# EAGLE design zeta2rework (EAGLE 9.0.1)
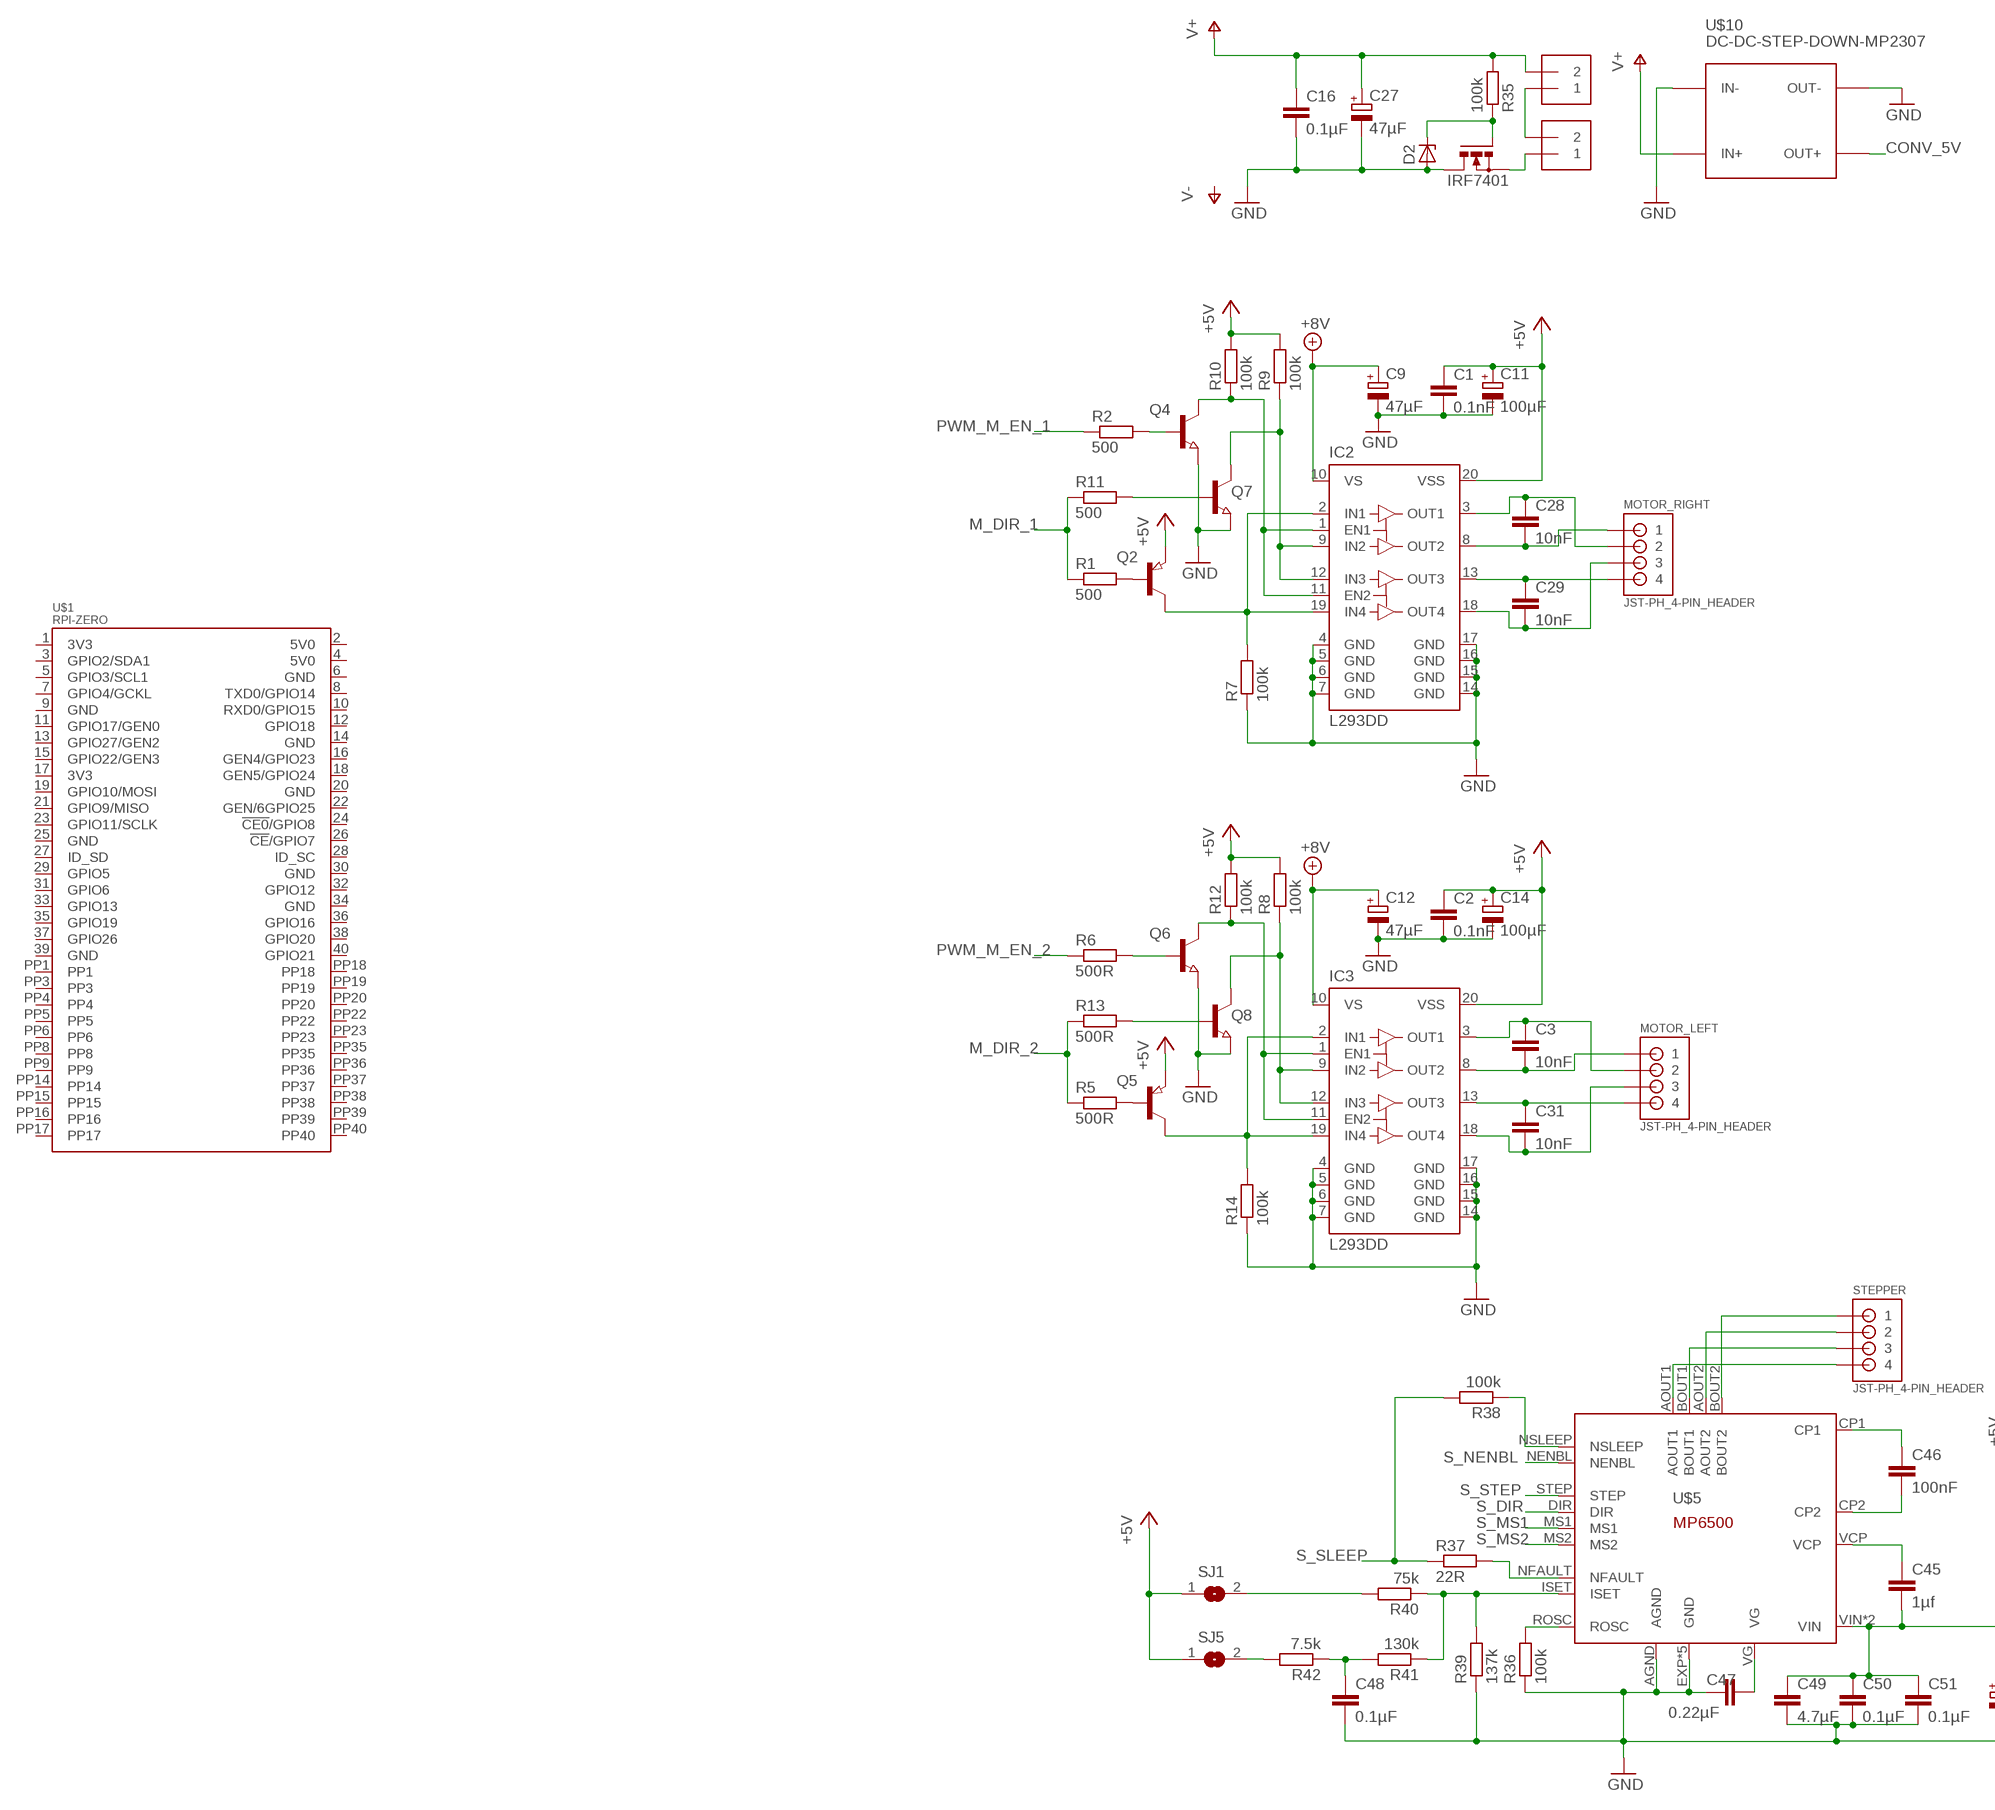
[diagram p0: schematic, sheet 1, part 1 of 2]
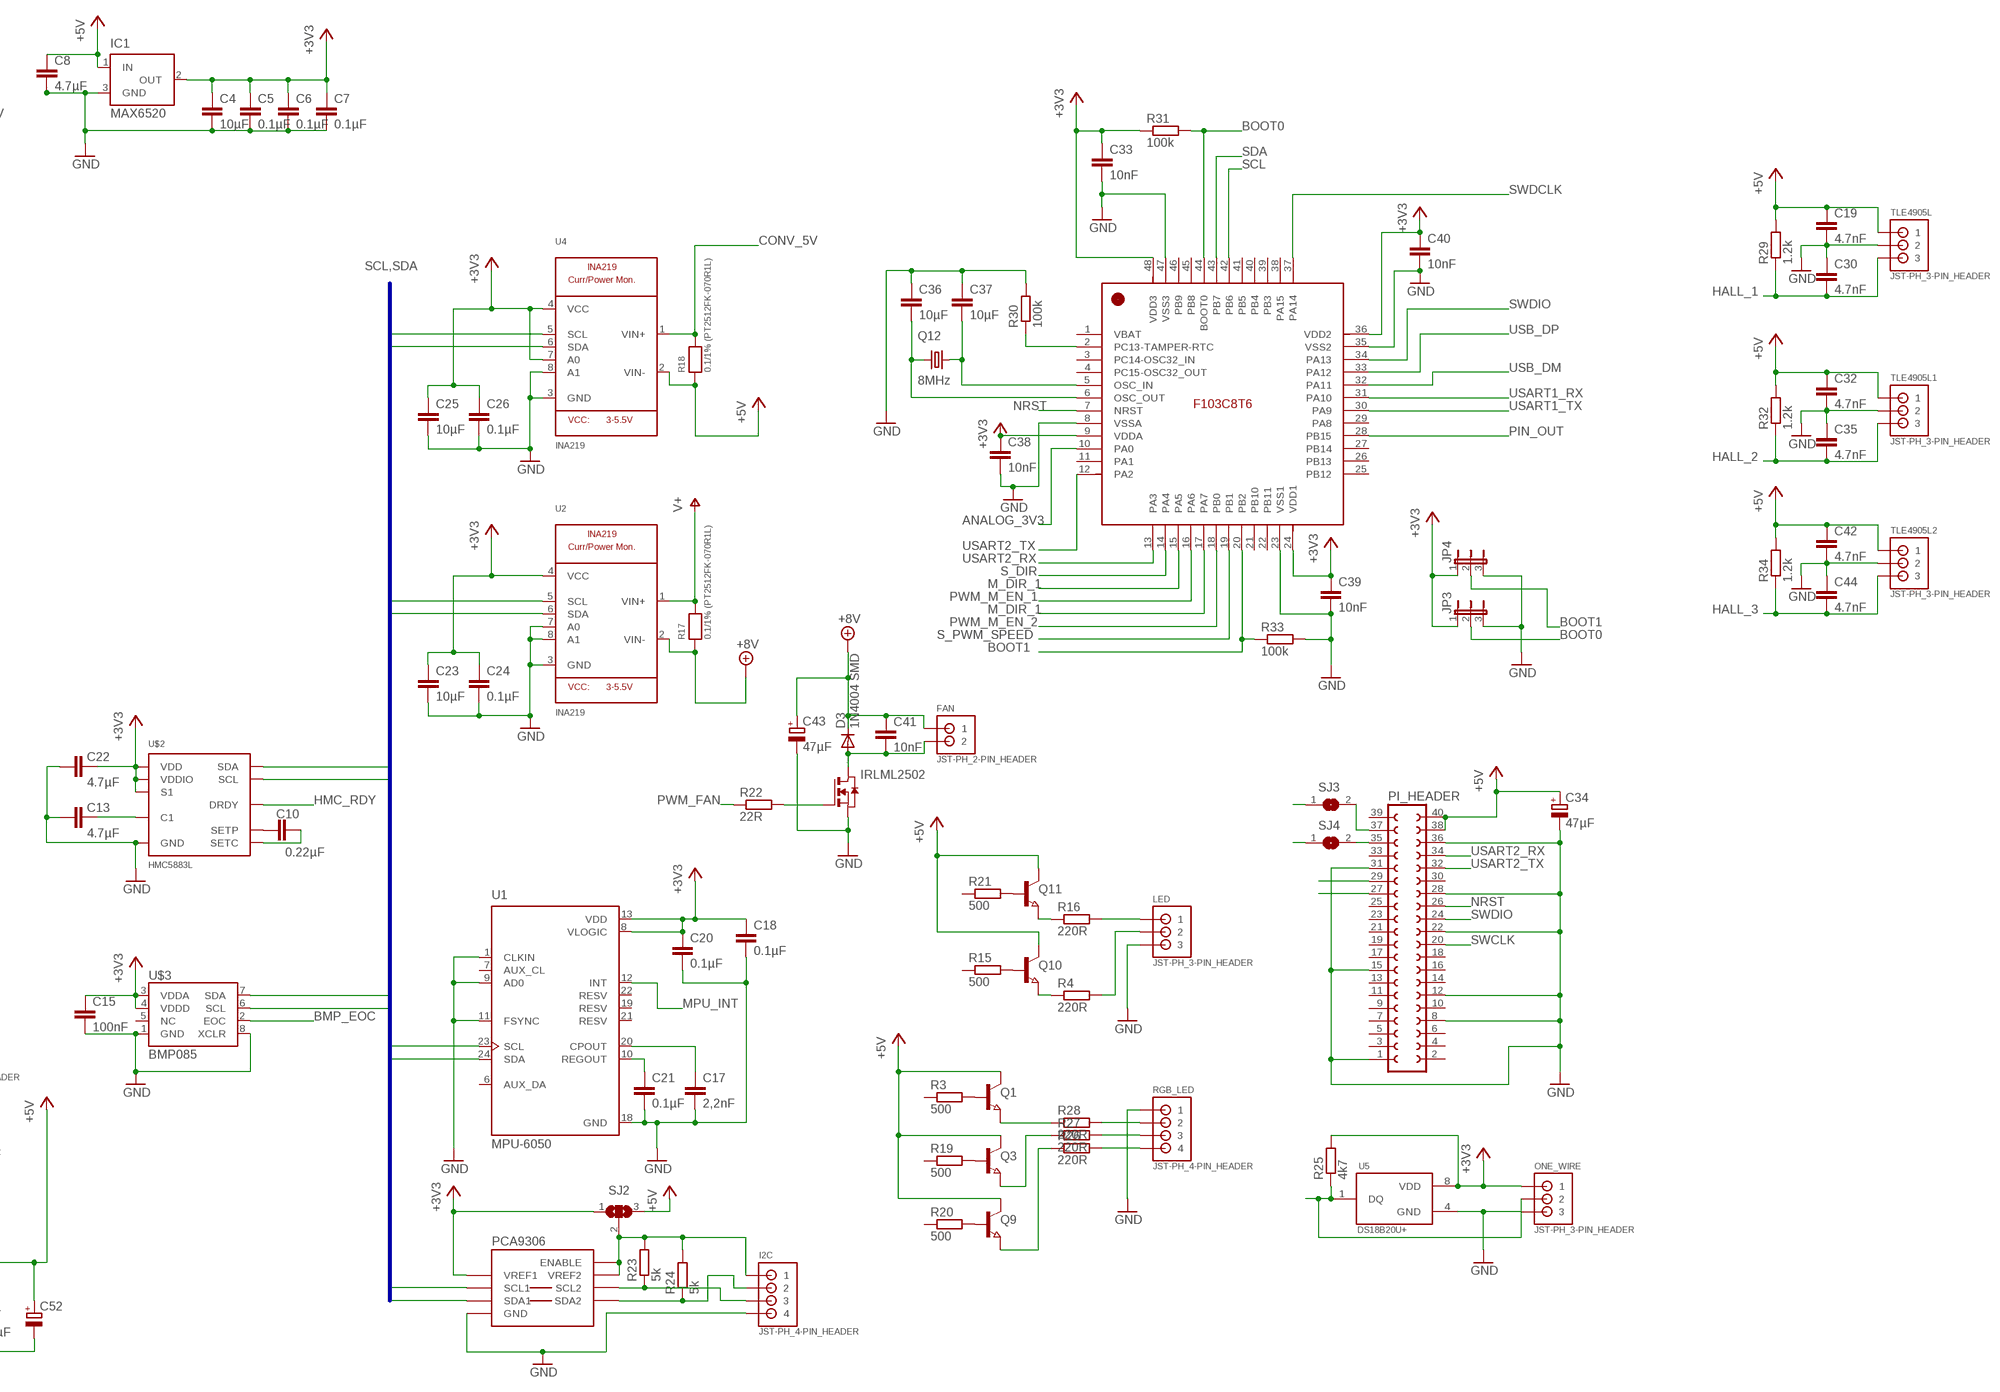
[diagram p1: schematic, sheet 1, part 2 of 2]

## Parts
C1  0.1nF  C-EUC0603  [C0603]
C2  0.1nF  C-EUC0603  [C0603]
C3  10nF  C-EUC0603  [C0603]
C4  10µF  C-EUC0603  [C0603]
C5  0.1µF  C-EUC0603  [C0603]
C6  0.1µF  C-EUC0603  [C0603]
C7  0.1µF  C-EUC0603  [C0603]
C8  4.7µF  C-EUC0603  [C0603]
C9  47µF  CPOL-EUSMCC  [SMC_C]
C10  0.22µF  C-EUC0603  [C0603]
C11  100µF  CPOL-EUSMCC  [SMC_C]
C12  47µF  CPOL-EUSMCC  [SMC_C]
C13  4.7µF  C-EUC0603  [C0603]
C14  100µF  CPOL-EUSMCC  [SMC_C]
C15  100nF  C-EUC0603  [C0603]
C16  0.1µF  C-EUC0603  [C0603]
C17  2,2nF  C-EUC0603  [C0603]
C18  0.1µF  C-EUC0603  [C0603]
C19  4.7nF  C-EUC0603  [C0603]
C20  0.1µF  C-EUC0603  [C0603]
C21  0.1µF  C-EUC0603  [C0603]
C22  4.7µF  C-EUC0603  [C0603]
C23  10µF  C-EUC0603  [C0603]
C24  0.1µF  C-EUC0603  [C0603]
C25  10µF  C-EUC0603  [C0603]
C26  0.1µF  C-EUC0603  [C0603]
C27  47µF  CPOL-EUSMCC  [SMC_C]
C28  10nF  C-EUC0603  [C0603]
C29  10nF  C-EUC0603  [C0603]
C30  4.7nF  C-EUC0603  [C0603]
C31  10nF  C-EUC0603  [C0603]
C32  4.7nF  C-EUC0603  [C0603]
C33  10nF  C-EUC0603  [C0603]
C34  47µF  CPOL-EUSMCC  [SMC_C]
C35  4.7nF  C-EUC0603  [C0603]
C36  10µF  C-EUC0603  [C0603]
C37  10µF  C-EUC0603  [C0603]
C38  10nF  C-EUC0603  [C0603]
C39  10nF  C-EUC0603  [C0603]
C40  10nF  C-EUC0603  [C0603]
C41  10nF  C-EUC0603  [C0603]
C42  4.7nF  C-EUC0603  [C0603]
C43  47µF  CPOL-EUSMCC  [SMC_C]
C44  4.7nF  C-EUC0603  [C0603]
C45  1µf  C-EUC0603  [C0603]
C46  100nF  C-EUC0603  [C0603]
C47  0.22µF  C-EUC0603  [C0603]
C48  0.1µF  C-EUC0603  [C0603]
C49  4.7µF  C-EUC0603  [C0603]
C50  0.1µF  C-EUC0603  [C0603]
C51  0.1µF  C-EUC0603  [C0603]
C52  CPOL-EU150CLZ-0810  [150CLZ-0810]
D2  ZENER-DIODESOD80C  [SOD80C]
D3  1N4004 SMD  DIODE-MELF-MLL41  [MELF-MLL41]
FAN  JST-PH_2-PIN_HEADER  [JST_B2B-PH_HEADER]
I2C  JST-PH_4-PIN_HEADER  [JST_B4B-PH_HEADER]
IC1  MAX6520  [SOT23]
IC2  L293DD  [SO20]
IC3  L293DD  [SO20]
IRF7401  N-MOSFET-SO8S  [SO-08]
IRLML2502  NMOSSOT23  [SOT-23]
JP3  JP2E  [JP2]
JP4  JP2E  [JP2]
LED  JST-PH_3-PIN_HEADER  [JST_B3B-PH_HEADER]
MOTOR_LEFT  JST-PH_4-PIN_HEADER  [JST_B4B-PH_HEADER]
MOTOR_RIGHT  JST-PH_4-PIN_HEADER  [JST_B4B-PH_HEADER]
ONE_WIRE  JST-PH_3-PIN_HEADER  [JST_B3B-PH_HEADER]
PCA9306  IC2_LEVEL_TRANSLATER  [SOIC-8]
PI_HEADER  FE20-2  [FE20-2]
Q1  NPN-TRANSISTOR_SOT23  [SOT23]
Q2  PNP-TRANSISTOR_SOT23  [SOT23]
Q3  NPN-TRANSISTOR_SOT23  [SOT23]
Q4  NPN-TRANSISTOR_SOT23  [SOT23]
Q5  PNP-TRANSISTOR_SOT23  [SOT23]
Q6  NPN-TRANSISTOR_SOT23  [SOT23]
Q7  NPN-TRANSISTOR_SOT23  [SOT23]
Q8  NPN-TRANSISTOR_SOT23  [SOT23]
Q9  NPN-TRANSISTOR_SOT23  [SOT23]
Q10  NPN-TRANSISTOR_SOT23  [SOT23]
Q11  NPN-TRANSISTOR_SOT23  [SOT23]
Q12  8MHz  KX-13  [7.0X5.0]
R1  500  R-EU_R0603  [R0603]
R2  500  R-EU_R0603  [R0603]
R3  500  R-EU_R0603  [R0603]
R4  220R  R-EU_R0603  [R0603]
R5  500R  R-EU_R0603  [R0603]
R6  500R  R-EU_R0603  [R0603]
R7  100k  R-EU_R0603  [R0603]
R8  100k  R-EU_R0603  [R0603]
R9  100k  R-EU_R0603  [R0603]
R10  100k  R-EU_R0603  [R0603]
R11  500  R-EU_R0603  [R0603]
R12  100k  R-EU_R0603  [R0603]
R13  500R  R-EU_R0603  [R0603]
R14  100k  R-EU_R0603  [R0603]
R15  500  R-EU_R0603  [R0603]
R16  220R  R-EU_R0603  [R0603]
R17  0.1/1% (PT2512FK-070R1L)  RESISTOR2512  [2512]
R18  0.1/1% (PT2512FK-070R1L)  RESISTOR2512  [2512]
R19  500  R-EU_R0603  [R0603]
R20  500  R-EU_R0603  [R0603]
R21  500  R-EU_R0603  [R0603]
R22  22R  R-EU_R0603  [R0603]
R23  5k  R-EU_R0603  [R0603]
R24  5k  R-EU_R0603  [R0603]
R25  4k7  R-EU_R0603  [R0603]
R26  220R  R-EU_R0603  [R0603]
R27  220R  R-EU_R0603  [R0603]
R28  220R  R-EU_R0603  [R0603]
R29  1.2k  R-EU_R0603  [R0603]
R30  100k  R-EU_R0603  [R0603]
R31  100k  R-EU_R0603  [R0603]
R32  1.2k  R-EU_R0603  [R0603]
R33  100k  R-EU_R0603  [R0603]
R34  1.2k  R-EU_R0603  [R0603]
R35  100k  R-EU_R0603  [R0603]
R36  100k  R-EU_R0603  [R0603]
R37  22R  R-EU_R0603  [R0603]
R38  100k  R-EU_R0603  [R0603]
R39  137k  R-EU_R0603  [R0603]
R40  75k  R-EU_R0603  [R0603]
R41  130k  R-EU_R0603  [R0603]
R42  7.5k  R-EU_R0603  [R0603]
RGB_LED  JST-PH_4-PIN_HEADER  [JST_B4B-PH_HEADER]
SJ1  SOLDERJUMPERREFLOW_NOPASTE  [SOLDERJUMPER_REFLOW_NOPASTE]
SJ2  SJ2W  [SJ_2]
SJ3  SOLDERJUMPERREFLOW_NOPASTE  [SOLDERJUMPER_REFLOW_NOPASTE]
SJ4  SOLDERJUMPERREFLOW_NOPASTE  [SOLDERJUMPER_REFLOW_NOPASTE]
SJ5  SOLDERJUMPERREFLOW_NOPASTE  [SOLDERJUMPER_REFLOW_NOPASTE]
STEPPER  JST-PH_4-PIN_HEADER  [JST_B4B-PH_HEADER]
SUPPLY_IN  TERMBLOCK_1X2-3.5MM  [1X2-3.5MM]
SUPPLY_IN1  TERMBLOCK_1X2-3.5MM  [1X2-3.5MM]
TLE4905L  JST-PH_3-PIN_HEADER  [JST_B3B-PH_HEADER]
TLE4905L1  JST-PH_3-PIN_HEADER  [JST_B3B-PH_HEADER]
TLE4905L2  JST-PH_3-PIN_HEADER  [JST_B3B-PH_HEADER]
U1  MPU-6050  [QFN50P400X400X95-24N]
U2  INA219  [SOT23-8]
U4  INA219  [SOT23-8]
U5  DS18B20U+  [SOP65P490X95-8N]
U$1  RPI-ZERO  [RASP_PI_ZERO_BOARD_FULL]
U$2  HMC5883L  [LPCC-16]
U$3  BMP085  [BMP085]
U$4  STM32F103C8T6  [LQFP48_7X7MM_0.5MMPP]
U$5  MP6500  [QFN24]
U$10  DC-DC-STEP-DOWN-MP2307  [DC-DC-STEP-DOWN-MP2307]

## Nets
+3V3: C4.1 C5.1 C6.1 C7.1 C15.1 C18.1 C20.1 C22.1 C23.1 C24.1 C25.1 C26.1 C33.1 C38.1 C39.1 C40.1 IC1.2(OUT) JP3.1 JP4.1 ONE_WIRE.P1 PCA9306.1(VREF1) R25.2 R31.1 SJ2.1 U1.8(VLOGIC) U1.13(VDD) U2.4(VCC) U4.4(VCC) U4.7(A0) U5.8(VDD) U$2.2(VDD) U$2.4(S1) U$2.13(VDDIO) U$3.3(VDDA) U$3.4(VDDD) U$4.9(VDDA) U$4.24(VDD1) U$4.36(VDD2) U$4.48(VDD3)
+5V: C1.1 C2.1 C8.1 C11.+ C14.+ C19.1 C32.1 C34.+ C42.1 C45.2 C49.1 C50.1 C51.1 C52.+ IC1.1(IN) IC2.20(VSS) IC3.20(VSS) PI_HEADER.38 PI_HEADER.40 Q1.3(C) Q2.2(E) Q3.3(C) Q5.2(E) Q9.3(C) Q10.3(C) Q11.3(C) R8.2 R9.2 R10.2 R12.2 R18.1 R29.2 R32.2 R34.2 SJ1.1 SJ2.3 SJ5.1 TLE4905L1.P1 TLE4905L2.P1 TLE4905L.P1 U4.2(VIN-) U$5.VIN U$5.VIN@1(VIN)
+8V: C9.+ C12.+ C41.1 C43.+ D3.C FAN.P1 IC2.10(VS) IC3.10(VS) R17.1 U2.2(VIN-)
ANALOG_3V3: U$4.10(PA0)
BMP_EOC: U$3.2(EOC)
BOOT0: JP3.2 R31.2 U$4.44(BOOT0)
BOOT1: JP4.2 R33.1 U$4.20(PB2)
BOOT2: PI_HEADER.29
BOOT3: PI_HEADER.27
CONV_5V: R18.2 U4.1(VIN+) U$10.OUT+
GND: C1.2 C2.2 C4.2 C5.2 C6.2 C7.2 C8.2 C9.- C11.- C12.- C13.2 C14.- C15.2 C16.2 C17.2 C18.2 C19.2 C20.2 C21.2 C22.2 C23.2 C24.2 C25.2 C26.2 C27.- C30.1 C32.2 C33.2 C34.- C35.1 C36.1 C37.1 C38.2 C39.2 C40.2 C42.2 C43.- C44.1 C47.1 C48.2 C49.2 C50.2 C51.2 C52.- D2.A I2C.P4 IC1.3(GND) IC2.4(GND) IC2.5(GND) IC2.6(GND) IC2.7(GND) IC2.14(GND) IC2.15(GND) IC2.16(GND) IC2.17(GND) IC3.4(GND) IC3.5(GND) IC3.6(GND) IC3.7(GND) IC3.14(GND) IC3.15(GND) IC3.16(GND) IC3.17(GND) IRF7401.5(D) IRF7401.6(D) IRF7401.7(D) IRF7401.8(D) IRLML2502.2(S) JP3.3 JP4.3 LED.P3 ONE_WIRE.P3 PCA9306.4(GND) PI_HEADER.1 PI_HEADER.8 PI_HEADER.12 PI_HEADER.15 PI_HEADER.22 PI_HEADER.28 PI_HEADER.31 PI_HEADER.36 Q4.2(E) Q6.2(E) Q7.2(E) Q8.2(E) R7.1 R14.1 R30.2 R33.2 R36.1 R39.1 RGB_LED.P1 TLE4905L1.P2 TLE4905L2.P2 TLE4905L.P2 U1.1(CLKIN) U1.9(AD0) U1.11(FSYNC) U1.18(GND) U2.3(GND) U2.7(A0) U2.8(A1) U4.3(GND) U4.8(A1) U5.4(GND) U$2.9(GND) U$2.11(GND) U$3.1(GND) U$3.8(XCLR) U$4.8(VSSA) U$4.23(VSS1) U$4.35(VSS2) U$4.47(VSS3) U$5.AGND U$5.EXP(GND) U$5.GND@1(GND) U$5.GND@2(GND) U$5.GND@3(GND) U$5.GND@4(GND) U$10.IN- U$10.OUT-
HALL_1: C30.2 R29.1 TLE4905L.P3
HALL_2: C35.2 R32.1 TLE4905L1.P3
HALL_3: C44.2 R34.1 TLE4905L2.P3
HMC_RDY: U$2.15(DRDY)
M_DIR_1: R1.1 R11.1 U$4.15(PA5) U$4.17(PA7)
M_DIR_2: R5.1 R13.1
MPU_INT: U1.12(INT)
N$1: IC2.9(IN2) IC2.12(IN3) Q7.3(C) R9.1
N$2: C31.2 IC3.18(OUT4) MOTOR_LEFT.P3
N$3: C31.1 IC3.13(OUT3) MOTOR_LEFT.P4
N$4: R26.2 RGB_LED.P4
N$5: IC2.2(IN1) IC2.19(IN4) Q2.3(C) R7.2
N$6: IC3.9(IN2) IC3.12(IN3) Q8.3(C) R8.1
N$7: IC3.2(IN1) IC3.19(IN4) Q5.3(C) R14.2
N$8: IC2.1(EN1) IC2.11(EN2) Q4.3(C) R10.1
N$9: IC3.1(EN1) IC3.11(EN2) Q6.3(C) R12.1
N$10: Q2.1(B) R1.2
N$11: Q7.1(B) R11.2
N$12: Q4.1(B) R2.2
N$13: Q5.1(B) R5.2
N$14: Q6.1(B) R6.2
N$15: Q8.1(B) R13.2
N$16: R27.2 RGB_LED.P3
N$17: C29.1 IC2.13(OUT3) MOTOR_RIGHT.P4
N$18: C29.2 IC2.18(OUT4) MOTOR_RIGHT.P3
N$19: R28.2 RGB_LED.P2
N$20: C28.2 IC2.8(OUT2) MOTOR_RIGHT.P1
N$21: C28.1 IC2.3(OUT1) MOTOR_RIGHT.P2
N$22: Q1.1(B) R3.2
N$23: Q3.1(B) R19.2
N$24: Q1.2(E) R28.1
N$25: C3.2 IC3.8(OUT2) MOTOR_LEFT.P1
N$26: C3.1 IC3.3(OUT1) MOTOR_LEFT.P2
N$27: Q10.1(B) R15.2
N$28: Q3.2(E) R27.1
N$29: Q9.2(E) R26.1
N$30: Q10.2(E) R4.1
N$31: Q11.1(B) R21.2
N$32: Q9.1(B) R20.2
N$33: Q11.2(E) R16.1
N$34: C17.1 U1.20(CPOUT)
N$35: LED.P1 R16.2
N$36: C21.1 U1.10(REGOUT)
N$37: IRLML2502.3(G) R22.2
N$38: C10.2 U$2.12(SETC)
N$39: C10.1 U$2.8(SETP)
N$40: C13.1 U$2.10(C1)
N$41: I2C.P1 PCA9306.7(VREF2) PCA9306.8(ENABLE) R23.2 R24.2 SJ2.2
N$42: I2C.P3 PCA9306.6(SCL2) R23.1
N$43: I2C.P2 PCA9306.5(SDA2) R24.1
N$44: PI_HEADER.37 SJ3.2
N$45: PI_HEADER.35 SJ4.2
N$46: C36.2 Q12.1 U$4.6(OSC_OUT)
N$47: C37.2 Q12.3 U$4.5(OSC_IN)
N$48: LED.P2 R4.2
N$49: R30.1 U$4.2(PC13-TAMPER-RTC)
N$50: SUPPLY_IN1.2 SUPPLY_IN.1
N$51: C45.1 U$5.VCP
N$52: R38.1 U$5.NSLEEP
N$53: C46.2 U$5.CP2
N$54: C46.1 U$5.CP1
N$55: C41.2 D3.A FAN.P2 IRLML2502.1(D)
N$56: D2.C IRF7401.4(G) R35.1
N$57: C47.2 U$5.VG
N$58: R36.2 U$5.ROSC
N$59: R37.2 U$5.NFAULT
N$60: IRF7401.1(S) IRF7401.2(S) IRF7401.3(S) SUPPLY_IN1.1
N$61: STEPPER.P1 U$5.BOUT2
N$62: STEPPER.P2 U$5.AOUT2
N$63: R39.2 R40.1 R41.1 U$5.ISET
N$64: STEPPER.P3 U$5.BOUT1
N$65: R40.2 SJ1.2
N$66: R42.2 SJ5.2
N$67: C48.1 R41.2 R42.1
N$68: STEPPER.P4 U$5.AOUT1
NRST: PI_HEADER.26 U$4.7(NRST)
PIN_OUT: U$4.28(PB15)
PWM_FAN: R22.1
PWM_M_EN_1: R2.1 U$4.16(PA6)
PWM_M_EN_2: R6.1 U$4.18(PB0)
S_DIR: U$4.14(PA4) U$5.DIR
S_MS1: U$5.MS1
S_MS2: U$5.MS2
S_NENBL: U$5.NENBL
S_PWM_SPEED: U$4.19(PB1)
S_SLEEP: R37.1 R38.2
S_STEP: U$5.STEP
SCL: U1.23(SCL) U2.5(SCL) U4.5(SCL) U$3.6(SCL) U$4.42(PB6)
SCL1: U$2.1(SCL)
SCL2: PCA9306.2(SCL1)
SCL3: SJ4.1
SDA: U1.24(SDA) U2.6(SDA) U4.6(SDA) U$3.7(SDA) U$4.43(PB7)
SDA1: U$2.16(SDA)
SDA2: PCA9306.3(SDA1)
SDA3: SJ3.1
SWCLK: PI_HEADER.20
SWDCLK: U$4.37(PA14)
SWDIO: PI_HEADER.24 U$4.34(PA13)
TEMPERATURE: ONE_WIRE.P2 R25.1 U5.1(DQ)
USART1_RX: U$4.31(PA10)
USART1_TX: U$4.30(PA9)
USART2_RX: PI_HEADER.34 U$4.13(PA3)
USART2_TX: PI_HEADER.32 U$4.12(PA2)
USB_DM: U$4.32(PA11)
USB_DP: U$4.33(PA12)
V+: C16.1 C27.+ R17.2 R35.2 SUPPLY_IN.2 U2.1(VIN+) U$10.IN+
Unconnected: PI_HEADER.2 PI_HEADER.3 PI_HEADER.4 PI_HEADER.5 PI_HEADER.6 PI_HEADER.7 PI_HEADER.9 PI_HEADER.10 PI_HEADER.11 PI_HEADER.13 PI_HEADER.14 PI_HEADER.16 PI_HEADER.17 PI_HEADER.18 PI_HEADER.19 PI_HEADER.21 PI_HEADER.23 PI_HEADER.25 PI_HEADER.30 PI_HEADER.33 PI_HEADER.39 R3.1 R15.1 R19.1 R20.1 R21.1 U1.6(AUX_DA) U1.7(AUX_CL) U1.19(RESV) U1.21(RESV) U1.22(RESV) U$1.1(3V3) U$1.2(5V0) U$1.3(GPIO2/SDA1) U$1.4(5V0) U$1.5(GPIO3/SCL1) U$1.6(GND) U$1.7(GPIO4/GCKL) U$1.8(TXD0/GPIO14) U$1.9(GND) U$1.10(RXD0/GPIO15) U$1.11(GPIO17/GEN0) U$1.12(GPIO18) U$1.13(GPIO27/GEN2) U$1.14(GND) U$1.15(GPIO22/GEN3) U$1.16(GEN4/GPIO23) U$1.17(3V3) U$1.18(GEN5/GPIO24) U$1.19(GPIO10/MOSI) U$1.20(GND) U$1.21(GPIO9/MISO) U$1.22(GEN/6GPIO25) U$1.23(GPIO11/SCLK) U$1.24(!CE0!/GPIO8) U$1.25(GND) U$1.26(!CE!/GPIO7) U$1.27(ID_SD) U$1.28(ID_SC) U$1.29(GPIO5) U$1.30(GND) U$1.31(GPIO6) U$1.32(GPIO12) U$1.33(GPIO13) U$1.34(GND) U$1.35(GPIO19) U$1.36(GPIO16) U$1.37(GPIO26) U$1.38(GPIO20) U$1.39(GND) U$1.40(GPIO21) U$1.PP1 U$1.PP3 U$1.PP4 U$1.PP5 U$1.PP6 U$1.PP8 U$1.PP9 U$1.PP14 U$1.PP15 U$1.PP16 U$1.PP17 U$1.PP18 U$1.PP19 U$1.PP20 U$1.PP22 U$1.PP23 U$1.PP35 U$1.PP36 U$1.PP37 U$1.PP38 U$1.PP39 U$1.PP40 U$3.5(NC) U$4.1(VBAT) U$4.3(PC14-OSC32_IN) U$4.4(PC15-OSC32_OUT) U$4.11(PA1) U$4.21(PB10) U$4.22(PB11) U$4.25(PB12) U$4.26(PB13) U$4.27(PB14) U$4.29(PA8) U$4.38(PA15) U$4.39(PB3) U$4.40(PB4) U$4.41(PB5) U$4.45(PB8) U$4.46(PB9)

## Buses
SCL,SDA

## Library data of the parts
C1-C8 C10 C13 C15-C26 C28-C33 C35-C42 C44-C51 = rcl:C-EU: CAPACITOR, European symbol; SPICEPREFIX: C
C9 C11 C12 C14 C27 C34 C43 C52 = rcl:CPOL-EU: POLARIZED CAPACITOR, European symbol; SPICEPREFIX: C
D2 = diode:ZENER-DIODE: Z-Diode
D3 = diode:DIODE-: DIODE
FAN = srg:JST-PH_2-PIN_HEADER: 2-pin JST PH Shrouded Header, top entry P/N B2B-PH-K-S Mating connector PHR-2 Mating cable assembly: Sparkfun PRT-09914 <http://www.sparkfun.com/products/9914>
I2C MOTOR_LEFT MOTOR_RIGHT RGB_LED STEPPER = srg:JST-PH_4-PIN_HEADER: 4-pin JST PH Shrouded Header, top entry P/N B4B-PH-K-S Mating connector PHR-4 Mating cable assembly: Sparkfun PRT-09916 <http://www.sparkfun.com/products/9916>
IC1 = maxim:MAX6520: 1.2V Voltage Reference 50ppm/°C, SOT23, 3-Terminal Source: Data sheet <http://datasheets.maxim-ic.com/en/ds/MAX6520.pdf>; MF: MAXIM; MPN: MAX6520EUR-T; OC_FARNELL: unknown; OC_NEWARK: 02J4586
IC2 IC3 = st-microelectronics:L293DD: PUSH-PULL FOUR CHANNEL DRIVER WITH DIODES Source: http://www.st.com/stonline/books/pdf/docs/1330.pdf; OC_FARNELL: unknown
IRF7401 = transistor-power:N-MOSFET-SO8: N-Channel MOSFET Example: FDS7760A; N-Channel Logic Level PowerTrench® MOSFET FDS2572; N-Channel UltraFET® Trench MOSFET Source: www.fairchildsemi.com
IRLML2502 = zetex:NMOSSOT23: MOS FET; OC_FARNELL: unknown; OC_NEWARK: unknown
JP3 JP4 = jumper:JP2E: JUMPER
LED ONE_WIRE TLE4905L TLE4905L1 TLE4905L2 = srg:JST-PH_3-PIN_HEADER: 3-pin JST PH Shrouded Header, top entry P/N B3B-PH-K-S Mating connector PHR-3
PCA9306 = srg:IC2_LEVEL_TRANSLATER: I2C Level Translator PCA9306 Data Sheet <http://www.ti.com/lit/ds/symlink/pca9306.pdf> Sparkfun breakout board schematic <http://dlnmh9ip6v2uc.cloudfront.net/datasheets/BreakoutBoards/PCA9306_Breakout.pdf>
PI_HEADER = con-lsta:FE20-2: FEMALE HEADER; OC_FARNELL: unknown; OC_NEWARK: unknown
Q1 Q3 Q4 Q6-Q11 = semicon-smd-ipc:NPN-TRANSISTOR_: NPN TRANSISTOR
Q2 Q5 = semicon-smd-ipc:PNP-TRANSISTOR_: PNP TRANSISTOR
Q12 = crystal-geyer_V1_0:KX: Quartz Crystals (MHz) SMD: KX - Serie Model Size l/w/h [mm] Frequency Range Frequency Stability Temp. Range [°C] Load Capacitance AECQ 200 availabel Datasheet KX-4 KX-5 KX-6 KX-7 KX-9A KX-9B KX-12A KX-12B KX-13 KX-20 KX-K KX-KS 1.6/1.2/0.3 2.0/1.6/0.45 2.5/2.0/0.55 3.2/2.5/0.8 5.0/3.2/1.0 5.0/3.2/1.1 6.0/3.5/1.1 6.0/3.5/1.0 7.0/5.0 /1.3 11.6/5.5/1.6 12.3/4.5/4.2 12.3/4.5/3.2 24.0 ~ 80.0 MHz 16.0 ~ 80.0 MHz 12.0 ~ 80.0 MHz 8.0 ~ 60.0 MHz 7,68 ~ 300,0 MHz 8,0 ~ 50,0 MHz 8,0 ~ 150,0 MHz 8,0 ~ 50,0 MHz 6,0 ~ 160,0 MHz 3,579 ~ 25,0 MHz 3,579 ~ 70,0 MHz 3,579 ~ 70,0 MHz ±10 … ±50ppm ±10 … ±50ppm ±10 … ±50ppm ±10 … ±50ppm ±10 … ±50ppm ±10 … ±50ppm ±10 … ±50ppm ±10 … ±50ppm ±10 … ±50ppm ±50ppm ±10 … ±50ppm ±10 … ±50ppm (*) -40°C …+85°C (*) -40°C …+125°C (*) -40°C …+125°C (*) -40°C …+125°C (*) -40°C …+105°C (*) -40°C …+105°C (*) -40°C …+125°C (*) -40°C …+105°C (*) -40°C …+105°C (*) -40°C …+105°C (*) -40°C …+85°C (*) -40°C …+85°C 8, 8…16 8, 8…16 10, 8…16 12, 7…20 16, 10…20 16, 10…20 16, 10…20 16, 12…20 16, 12…20 16, 12…20 16, 12…30 16, 12…30 - yes yes yes - - - - - - - - KX-4.pdf <http://www.geyer-electronic.de/uploads/tx_userartikelfrequenz/GEYER-KX-4.pdf> KX-5.pdf <http://www.geyer-electronic.de/uploads/tx_userartikelfrequenz/GEYER-KX-5.pdf> KX-6.pdf <http://www.geyer-electronic.de/uploads/tx_userartikelfrequenz/GEYER-KX-6.pdf> KX-7.pdf <http://www.geyer-electronic.de/uploads/tx_userartikelfrequenz/GEYER-KX-7.pdf> KX-9A.pdf <http://www.geyer-electronic.de/uploads/tx_userartikelfrequenz/GEYER-KX-9A.pdf> KX-9B.pdf <http://www.geyer-electronic.de/uploads/tx_userartikelfrequenz/GEYER-KX-9B.pdf> KX-12A.pdf <http://www.geyer-electronic.de/uploads/tx_userartikelfrequenz/GEYER-KX-12A.pdf> KX-12B.pdf <http://www.geyer-electronic.de/uploads/tx_userartikelfrequenz/GEYER-KX-12B.pdf> KX-13.pdf <http://www.geyer-electronic.de/uploads/tx_userartikelfrequenz/GEYER-KX-13.pdf> KX-20.pdf <http://www.geyer-electronic.de/uploads/tx_userartikelfrequenz/GEYER-KX-20.pdf> KX-K.pdf <http://www.geyer-electronic.de/uploads/tx_userartikelfrequenz/GEYER-KX-K.pdf> KX-KS.pdf <http://www.geyer-electronic.de/uploads/tx_userartikelfrequenz/GEYER-KX-KS.pdf> <http://www.geyer-electronic.de/fileadmin/template/img/logo-geyer-electronic.png> Details see: http://www.geyer-electronic.de/Frequenz-Produkte.9.0.html Created 2016-06-07, Hans Locher 2016 (C) Geyer Quartz Technology KX4,KX5,KX6,KX7,KX9A,KX9B,KX12A,KX12B,KX13,KX20,KXK,KXKS;1612;2016;2520;3225;5032;6035;7050;11655;12345;1,6x1,2;2,0x1,6;2,5x2,0;3,2x2,5;5,0x3,2;6,0x3,5;7,0x5,0;11,6x5,5;12,3x4,5;12,3x4,5;1.6x1.2;2.0x1.6;2.5x2.0;3.2x2.5;5.0x3.2;6.0x3.5;7.0x5.0;11.6x5.5;12.3x4.5;12.3x4.5;
R1-R16 R19-R42 = rcl:R-EU_: RESISTOR, European symbol; SPICEPREFIX: R
R17 R18 = microbuilder:RESISTOR: Resistors 0402 - 0402 Surface Mount Package 22 Ohm 1% 1/16W [Digikey: 311-22.0LRTR-ND] 33 Ohm 5% 1/16W 1.0K 5% 1/16W 1.5K 5% 1/16W 2.0K 1% 1/16W 10.0K 1% 1/16W [Digikey: 311-10.0KLRTR-ND] 10.0K 5% 1/16W [Digikey: RMCF0402JT10K0TR-ND] 12.1K 1% 1/16W [Digikey: 311-22.0LRTR-ND] 100.0K 5% 1/16W 0603 - 0603 Surface Mount Package 0 Ohm 1/10 Watt 1% Resistor 15 Ohm 1/10 Watt 1% Resistor 33 Ohm 1/10 Watt 1% Resistor 49.9 Ohm 1/10 Watt 1% Resistor 100 Ohm 1/10 Watt 1% Resistor 150 Ohm 1/10 Watt 1% Resistor 240 Ohm 1/10 Watt 1% Resistor 390 Ohm 1/10 Watt 1% Resistor 560 Ohm 1/10 Watt 1% Resistor 680 Ohm 1/10 Watt 1% Resistor 750 Ohm 1/10 Watt 1% Resistor 1.0K Ohm 1/10 Watt 1% Resistor 1.5K Ohm 1/10 Watt 1% Resistor 2.0K Ohm 1/10 Watt 1% Resistor 2.2K Ohm 1/10 Watt 1% Resistor 3.3K Ohm 1/10 Watt 1% Resistor 4.7K Ohm 1/10 Watt 1% Resistor 10.0K Ohm 1/10 Watt 1% Resistor 12.0K Ohm 1/10 Watt 1% Resistor 12.1K Ohm 1/10 Watt 1% Resistor 20.0K Ohm 1/10 Watt 1% Resistor 33.0K Ohm 1/10 Watt 1% Resistor 100.0K Ohm 1/10 Watt 1% Resistor 0805 - 0805 Surface Mount Package 0 Ohm 1/8 Watt 1% Resistor 33 Ohm 1/8 Watt 1% Resistor 100 Ohm 1/8 Watt 1% Resistor 150 Ohm 1/8 Watt 1% Resistor 200 Ohm 1/8 Watt 1% Resistor 240 Ohm 1/8 Watt 1% Resistor 330 Ohm 1/8 Watt 1% Resistor 390 Ohm 1/8 Watt 1% Resistor 470 Ohm 1/8 Watt 1% Resistor 1.0K Ohm 1/8 Watt 1% Resistor 1.5K Ohm 1/8 Watt 1% Resistor 2.0K Ohm 1/8 Watt 1% Resistor 4.7K Ohm 1/8 Watt 1% Resistor 5.1K Ohm 1/8 Watt 1% Resistor 5.6K Ohm 1/8 Watt 1% Resistor 10.0K Ohm 1/8 Watt 1% Resistor 22.0K Ohm 1/8 Watt 1% Resistor 33.0K Ohm 1/8 Watt 1% Resistor 100K Ohm 1/8 Watt 1% Resistor 1206 - 1206 Surface Mount Package 2012 - 2010 Surface Mount Package 0.11 Ohm 1/2 Watt 1% Resistor - Digikey: RHM.11UCT-ND
SJ1 SJ3-SJ5 = microbuilder:SOLDERJUMPER: SMD Solder JUMPER Solder the two pads together to create a connection, or remove the solder to break it. REFLOW - Use this footprint for solder paste and reflow ovens. WAVE - Use this footprint for hand-soldering (larger pads). CLOSED - Has a trace between the two pads to ensure it is closed by default. The trace needs to be cut to disable the jumper, and can be closed again by creating a solder bridge between the two pads.
SJ2 = jumper:SJ2W: SMD solder JUMPER
SUPPLY_IN SUPPLY_IN1 = microbuilder:TERMBLOCK_1X2: 3.5mm Terminal block http://www.ladyada.net/library/pcb/eaglelibrary.html
U1 = MPU-6050:MPU-6050: MPU-6050 Six-Axis (Gyro + Accelerometer) MEMS MotionTracking™ Devices; AVAILABILITY: Good; DESCRIPTION: 3-axis gyroscope, 3-axis accelerometer in a 4x4x0.9 housing; MF: TDK; MP: MPU-6050; PACKAGE: QFN-24 InvenSense; PRICE: 5.12 USD
U2 U4 = INA219:INA219: INA219 - I2C Current/Power Monitor Voltage Range: 0-26V Accuracy: 0.5% Temperature: -40°C - 125°C; AVAILABILITY: Unavailable; DESCRIPTION: the ina219 is a high-side current shunt and power monitor with an i2c interface. the ina219 monitors both shunt drop ...; MF: Texas Instruments; MP: INA219; PACKAGE: None; PRICE: None
U5 = DS18B20U_:DS18B20U+: Board Mount Temperature Sensors Prgmble Resolution 1-Wire Parasite Pwr; AVAILABILITY: Unavailable; DESCRIPTION: Date Code: 1043+; RoHS Compliant: Yes;; MF: Maxim; MP: DS18B20U+; PACKAGE: TSSOP-8 Chip Coolers; PRICE: None
U$1 = rpi-zero:RPI-ZERO
U$2 = HMC5883L:HMC5883L; AVAILABILITY: Unavailable; DESCRIPTION: Digital Compass +/- 0.8g, Lcc-16; MF: Honeywell; MP: HMC5883L-T; PACKAGE: LCC-16 Honeywell; PRICE: None
U$3 = BMP085:BMP085: BMP085 Pressure Sensor Great little MEMS pressure sensor. SKU: COM-09603; AVAILABILITY: Unavailable; MF: Bosch Sensortec; MP: BMP085; PACKAGE: CLCC-8 Bosch Sensortec; PRICE: None
U$4 = STM32F103C8T6:STM32F103C8T6; AVAILABILITY: Good; DESCRIPTION: Mainstream Performance line, ARM Cortex-M3 MCU with 64 Kbytes Flash, 72 MHz CPU, motor control, USB and CAN; MF: STMicroelectronics; MP: STM32F103C8T6; PACKAGE: LQFP-48 STMicroelectronics; PRICE: 3.83 USD
U$5 = mp6500:MP6500
U$10 = diy-modules:DC-DC-STEP-DOWN-MP2307: DC/DC Step-Down Regulator based on MP2307DN chip MP2307 datasheet available here: https://cdn-shop.adafruit.com/datasheets/MP2307_r1.9.pdf Click here to find device on ebay.com <http://www.ebay.com/sch/dc+dc+3a+mini+converter>

## Board
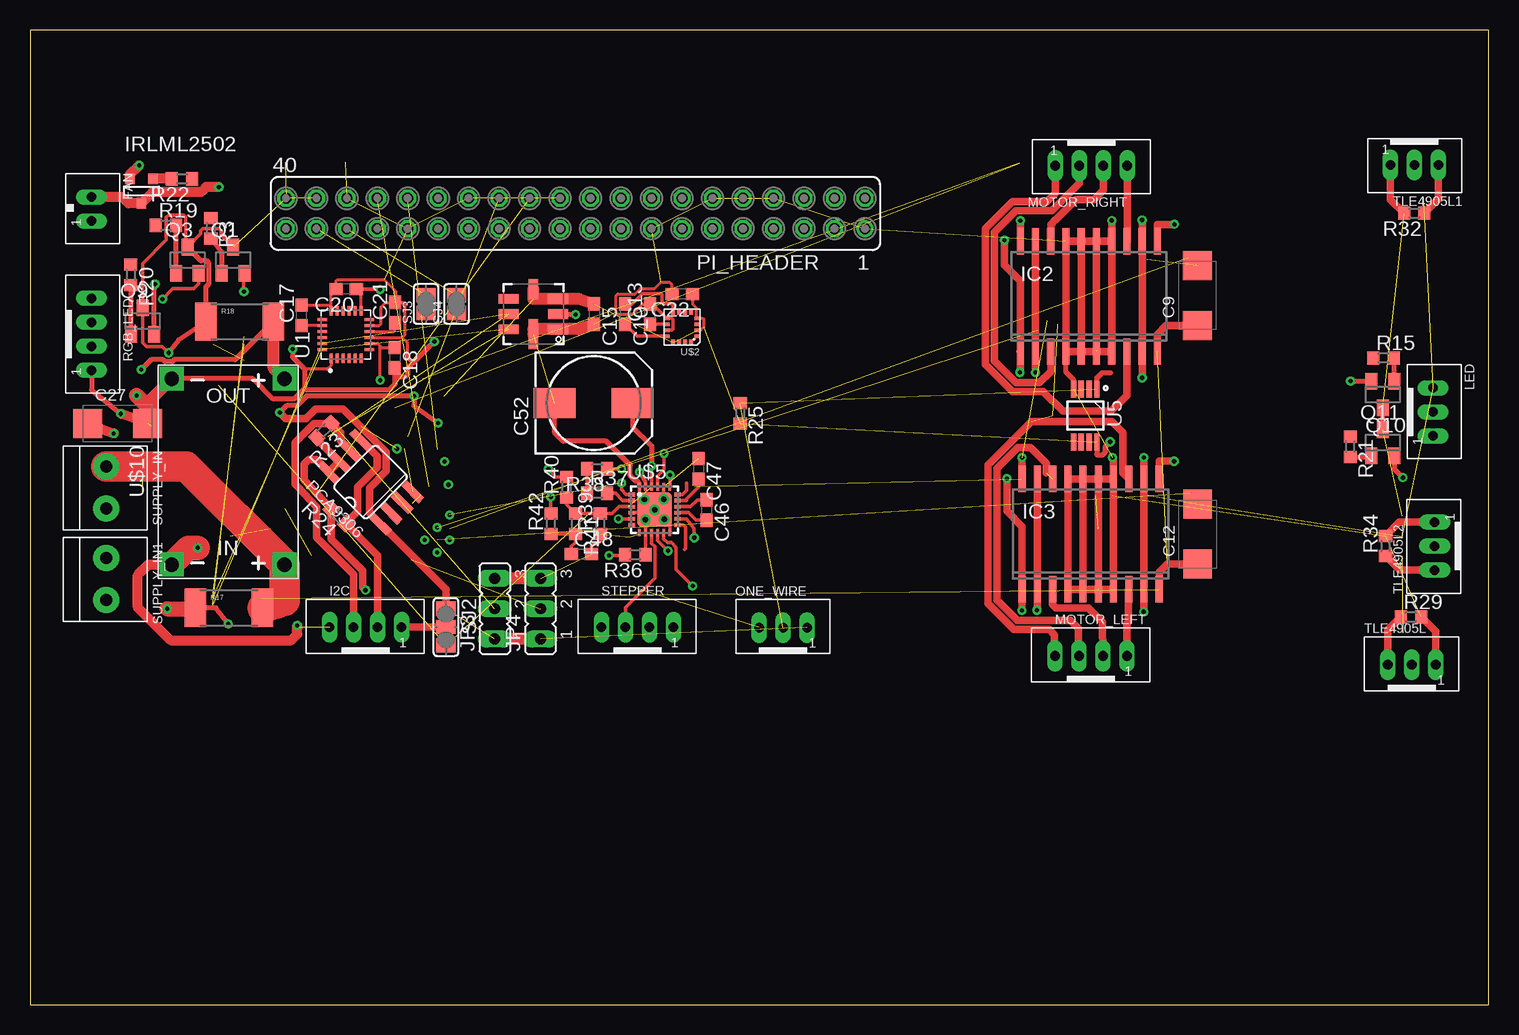
[diagram p2: board, top side]
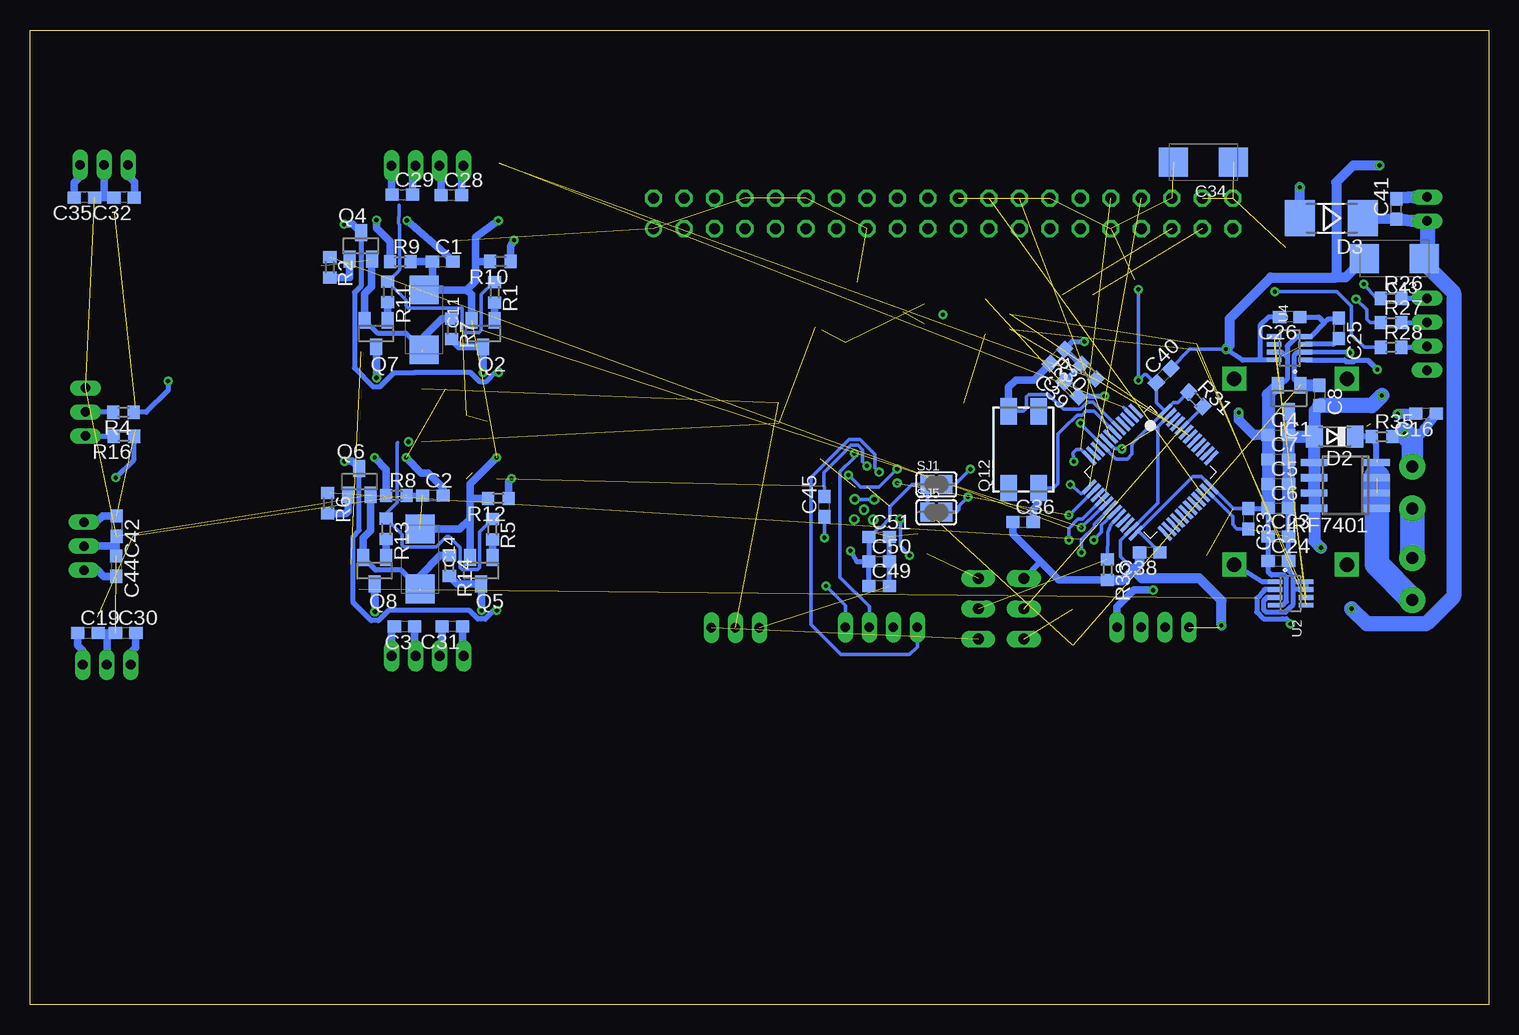
[diagram p3: board, bottom side, seen from below]

Size 121.59 x 81.27 mm. Coordinates in mm from the lower left corner, seen from the top.
Outline: 0,0 121.59,0 121.59,81.27 0,81.27 0,0
Copper layers (1*16): Top 0.035mm / dielectric 1.5mm / Bottom 0.035mm
Design rules "default": minimum track width 6mil, minimum drill 0.35mm, track to track 6mil, track to pad 6mil, pad to pad 6mil, via to via 6mil, smd to smd 6mil, copper to edge 40mil, drill to drill 6mil, minimum pad ring 10mil, minimum via ring 8mil, stop-mask expansion 4mil, vias tented up to drill 0mil, thermal gap 10mil

### Footprints (pad centres in the part's own frame; a part is rotated, then mirrored left to right if it is on the bottom)
C0603 = smd 1.1 x 1: 1 -0.85,0; 2 0.85,0
SMC_C = smd 2.4 x 2.4: + -2.5,0; - 2.5,0
150CLZ-0810 = smd 3.5 x 2.5: + 3.25,0; - -3.25,0
SOD80C = smd 1.4 x 1.8: A 1.7,0; C -1.7,0
MELF-MLL41 = smd 2.5 x 3: A 2.625,0; C -2.625,0
JST_B2B-PH_HEADER = drill 0.8 long: P1 1.075,0.048; P2 -0.925,0.048
JST_B4B-PH_HEADER = drill 0.8 long: P1 2.98,0.048; P2 0.98,0.048; P3 -1.02,0.048; P4 -3.02,0.048
SOT23 = smd 1 x 1.4: 1 -0.95,-1.1; 2 0.95,-1.1; 3 0,1.1
SO20 = smd 0.6 x 2.2: 1 -5.715,-4.6; 2 -4.445,-4.6; 3 -3.175,-4.6; 4 -1.905,-4.6; 5 -0.635,-4.6; 6 0.635,-4.6; 7 1.905,-4.6; 8 3.175,-4.6; 9 4.445,-4.6; 10 5.715,-4.6; 11 5.715,4.6; 12 4.445,4.6; 13 3.175,4.6; 14 1.905,4.6; 15 0.635,4.6; 16 -0.635,4.6; 17 -1.905,4.6; 18 -3.175,4.6; 19 -4.445,4.6; 20 -5.715,4.6
SO-08 = smd 0.6 x 2.2: 1 -1.905,-2.6; 2 -0.635,-2.6; 3 0.635,-2.6; 4 1.905,-2.6; 5 1.905,2.6; 6 0.635,2.6; 7 -0.635,2.6; 8 -1.905,2.6
SOT-23 = smd 0.787 x 0.889: 1 0.025,-1.016; 2 -0.94,1.016; 3 0.991,1.016
JP2 = drill 0.914 long: 1 -2.54,0; 2 0,0; 3 2.54,0
JST_B3B-PH_HEADER = drill 0.8 long: P1 2.027,0.048; P2 0.028,0.048; P3 -1.972,0.048
SOIC-8 = smd 0.66 x 2.032: 1 -1.905,-3.073; 2 -0.635,-3.073; 3 0.635,-3.073; 4 1.905,-3.073; 5 1.905,3.073; 6 0.635,3.073; 7 -0.635,3.073; 8 -1.905,3.073
FE20-2 = drill 0.914: 1 -24.13,1.27 | drill 0.914 octagon: 2 -24.13,-1.27; 3 -21.59,1.27; 4 -21.59,-1.27; 5 -19.05,1.27; 6 -19.05,-1.27; 7 -16.51,1.27; 8 -16.51,-1.27; 9 -13.97,1.27; 10 -13.97,-1.27; 11 -11.43,1.27; 12 -11.43,-1.27; 13 -8.89,1.27; 14 -8.89,-1.27; 15 -6.35,1.27; 16 -6.35,-1.27; 17 -3.81,1.27; 18 -3.81,-1.27; 19 -1.27,1.27; 20 -1.27,-1.27; 21 1.27,1.27; 22 1.27,-1.27; 23 3.81,1.27; 24 3.81,-1.27; 25 6.35,1.27; 26 6.35,-1.27; 27 8.89,1.27; 28 8.89,-1.27; 29 11.43,1.27; 30 11.43,-1.27; 31 13.97,1.27; 32 13.97,-1.27; 33 16.51,1.27; 34 16.51,-1.27; 35 19.05,1.27; 36 19.05,-1.27; 37 21.59,1.27; 38 21.59,-1.27; 39 24.13,1.27; 40 24.13,-1.27
7.0X5.0 = smd 2.2 x 1.4: 1 -3.2,-1.25; 2 3.2,-1.25; 3 3.2,1.25; 4 -3.2,1.25
R0603 = smd 1 x 1.1: 1 -0.85,0; 2 0.85,0
2512 = smd 1.8 x 3.2: 1 -2.8,0; 2 2.8,0
SOLDERJUMPER_REFLOW_NOPASTE = smd 1.168 x 1.6: 1 -0.762,0; 2 0.762,0
SJ_2 = smd 1.168 x 1.6: 1 -1.524,0; 2 0,0; 3 1.524,0
1X2-3.5MM = drill 1 pad 2.184: 1 1.8,0; 2 -1.7,0
QFN50P400X400X95-24N = smd 0.79 x 0.26: 1 -1.97,1.25; 2 -1.97,0.75; 3 -1.97,0.25; 4 -1.97,-0.25; 5 -1.97,-0.75; 6 -1.97,-1.25; 13 1.97,-1.25; 14 1.97,-0.75; 15 1.97,-0.25; 16 1.97,0.25; 17 1.97,0.75; 18 1.97,1.25 | smd 0.26 x 0.79: 7 -1.25,-1.97; 8 -0.75,-1.97; 9 -0.25,-1.97; 10 0.25,-1.97; 11 0.75,-1.97; 12 1.25,-1.97; 19 1.25,1.97; 20 0.75,1.97; 21 0.25,1.97; 22 -0.25,1.97; 23 -0.75,1.97; 24 -1.25,1.97
SOT23-8 = smd 0.4 x 1.2: 1 -0.975,-1.3; 2 -0.325,-1.3; 3 0.325,-1.3; 4 0.975,-1.3; 5 0.975,1.3; 6 0.325,1.3; 7 -0.325,1.3; 8 -0.975,1.3
SOP65P490X95-8N = smd 1.4 x 0.45: 1 -2.2,0.975; 2 -2.2,0.325; 3 -2.2,-0.325; 4 -2.2,-0.975; 5 2.2,-0.975; 6 2.2,-0.325; 7 2.2,0.325; 8 2.2,0.975
RASP_PI_ZERO_BOARD_FULL = drill 1 pad 1.778 square: 1 8.37,25.23 | drill 1 pad 1.778: 2 8.37,27.77; 3 10.91,25.23; 4 10.91,27.77; 5 13.45,25.23; 6 13.45,27.77; 7 15.99,25.23; 8 15.99,27.77; 9 18.53,25.23; 10 18.53,27.77; 11 21.07,25.23; 12 21.07,27.77; 13 23.61,25.23; 14 23.61,27.77; 15 26.15,25.23; 16 26.15,27.77; 17 28.69,25.23; 18 28.69,27.77; 19 31.23,25.23; 20 31.23,27.77; 21 33.77,25.23; 22 33.77,27.77; 23 36.31,25.23; 24 36.31,27.77; 25 38.85,25.23; 26 38.85,27.77; 27 41.39,25.23; 28 41.39,27.77; 29 43.93,25.23; 30 43.93,27.77; 31 46.47,25.23; 32 46.47,27.77; 33 49.01,25.23; 34 49.01,27.77; 35 51.55,25.23; 36 51.55,27.77; 37 54.09,25.23; 38 54.09,27.77; 39 56.63,25.23; 40 56.63,27.77 | drill 0.8 pad 1.778: PP1 10.699,4.832; PP3 7.593,8.858; PP4 7.133,14.38; PP5 55.796,23.124; PP6 10.699,2.301; PP8 5.177,8.858; PP9 9.549,14.38; PP14 58.327,18.407; PP15 55.796,14.265; PP16 55.796,20.363; PP17 58.212,21.743; PP18 55.796,17.027; PP19 58.327,15.186; PP20 56.832,9.434; PP35 17.257,2.416; PP36 60.628,12.425; PP37 56.026,2.071; PP38 53.726,2.416; PP39 58.097,12.54; PP40 18.867,6.212 | drill 0.8 pad 1.422: PP22 23.009,2.071; PP23 24.734,2.071 | hole 2.75: 3.5,3.5; 3.5,26.5; 61.5,3.5; 61.5,26.5
LPCC-16 = smd 0.45 x 0.3: 1 -1.275,0.75; 2 -1.275,0.25; 3 -1.275,-0.25; 4 -1.275,-0.75; 9 1.275,-0.75; 10 1.275,-0.25; 11 1.275,0.25; 12 1.275,0.75 | smd 0.3 x 0.45: 5 -0.75,-1.275; 6 -0.25,-1.275; 7 0.25,-1.275; 8 0.75,-1.275; 13 0.75,1.275; 14 0.25,1.275; 15 -0.25,1.275; 16 -0.75,1.275
BMP085 = smd 1.67 x 0.8: 1 -2.065,1.27; 2 -2.065,0; 3 -2.065,-1.27; 5 2.065,-1.27; 6 2.065,0; 7 2.065,1.27 | smd 0.8 x 1.67: 4 0,-2.065 | smd 0.8 x 2.5: 8 0,1.65
LQFP48_7X7MM_0.5MMPP = smd 1.5 x 0.3: 1 -4.45,2.75; 2 -4.45,2.25; 3 -4.45,1.75; 4 -4.45,1.25; 5 -4.45,0.75; 6 -4.45,0.25; 7 -4.45,-0.25; 8 -4.45,-0.75; 9 -4.45,-1.25; 10 -4.45,-1.75; 11 -4.45,-2.25; 12 -4.45,-2.75; 25 4.45,-2.75; 26 4.45,-2.25; 27 4.45,-1.75; 28 4.45,-1.25; 29 4.45,-0.75; 30 4.45,-0.25; 31 4.45,0.25; 32 4.45,0.75; 33 4.45,1.25; 34 4.45,1.75; 35 4.45,2.25; 36 4.45,2.75 | smd 0.3 x 1.5: 13 -2.75,-4.45; 14 -2.25,-4.45; 15 -1.75,-4.45; 16 -1.25,-4.45; 17 -0.75,-4.45; 18 -0.25,-4.45; 19 0.25,-4.45; 20 0.75,-4.45; 21 1.25,-4.45; 22 1.75,-4.45; 23 2.25,-4.45; 24 2.75,-4.45; 37 2.75,4.45; 38 2.25,4.45; 39 1.75,4.45; 40 1.25,4.45; 41 0.75,4.45; 42 0.25,4.45; 43 -0.25,4.45; 44 -0.75,4.45; 45 -1.25,4.45; 46 -1.75,4.45; 47 -2.25,4.45; 48 -2.75,4.45
QFN24 = smd 0.6 x 0.3: AGND -1.905,-0.254; CP1 1.905,0.254; CP2 1.905,-0.254; DIR -1.905,1.27; ISET -1.905,0.254; MS2 -1.905,-1.27; NENBL 1.905,1.27; NFAULT -1.905,0.762; ROSC -1.905,-0.762; STEP 1.905,-1.27; VCP 1.905,-0.762; VG 1.905,0.762 | smd 0.3 x 0.6: AOUT1 -0.762,1.905; AOUT2 0.254,1.905; BOUT1 -0.254,-1.905; BOUT2 0.762,-1.905; GND@1 -1.27,1.905; GND@2 0.762,1.905; GND@3 1.27,-1.905; GND@4 -0.762,-1.905; MS1 -1.27,-1.905; NSLEEP 1.27,1.905; VIN 0.254,-1.905; VIN@1 -0.254,1.905 | smd 2.9 x 2.9: EXP 0,0
DC-DC-STEP-DOWN-MP2307 = drill 1.2 pad 2 square: IN+ -7.747,-4.699; IN- -7.747,4.699; OUT+ 7.747,-4.699; OUT- 7.747,4.699

### Placement (x,y rotation side)
C1  87.2,61.95 0 bottom
C2  88.01,42.47 0 bottom
C3  90.37,31.52 180 bottom
C4  17.53,47.5 0 bottom
C5  17.53,43.43 0 bottom
C6  17.53,41.4 0 bottom
C7  17.53,45.47 0 bottom
C8  14.1,50.8 270 bottom
C9  97.31,59.13 90 top
C10  49.61,57.58 270 top
C11  88.75,57.1 270 bottom
C12  97.33,39.24 90 top
C13  51.69,57.58 90 top
C14  89.08,37.16 270 bottom
C15  47.04,57.58 270 top
C16  5.21,49.28 180 bottom
C17  22.66,57.48 90 top
C18  30.4,53.95 270 top
C19  116.76,31.01 0 bottom
C20  26.37,59.66 180 top
C21  30.43,57.71 90 top
C22  54.38,59.26 180 top
C23  17.53,39.04 0 bottom
C24  17.53,37.01 0 bottom
C25  12.48,56.39 270 bottom
C26  16.57,57.35 180 bottom
C27  7.3,48.45 0 top
C28  86.46,67.51 0 bottom
C29  90.55,67.54 0 bottom
C30  113.61,31.01 0 bottom
C31  86.39,31.55 180 bottom
C32  113.74,67.31 180 bottom
C33  20.04,40.51 270 bottom
C34  23.77,70.26 180 bottom
C35  117.04,67.31 180 bottom
C36  38.81,40.26 0 bottom
C37  35.94,54.05 225 bottom
C38  28.24,37.72 180 bottom
C39  34.8,51.31 135 bottom
C40  27.1,52.45 44.8 bottom
C41  7.7,66.34 90 bottom
C42  114.38,39.9 270 bottom
C43  7.85,62.2 180 bottom
C44  114.4,36.58 270 bottom
C45  55.37,41.53 90 bottom
C46  56.39,41.25 270 top
C47  55.73,44.68 270 top
C48  45.97,37.57 0 top
C49  50.8,34.92 0 bottom
C50  50.8,36.96 0 bottom
C51  50.8,38.99 0 bottom
C52  46.99,50.16 0 top
D2  12.83,47.37 180 bottom
D3  13.11,65.58 180 bottom
FAN  5.08,66.42 270 top
I2C  27.99,31.42 0 top
IC1  16.64,50.55 180 bottom
IC2  88.27,59.05 0 top
IC3  88.42,39.24 0 top
IRF7401  11.94,43.31 90 bottom
IRLML2502  9.27,67.84 0 top
JP3  38.74,33.02 90 top
JP4  42.55,33.02 90 top
LED  116.92,49.45 270 top
MOTOR_LEFT  88.47,29.03 0 top
MOTOR_RIGHT  88.44,70 180 top
ONE_WIRE  62.76,31.39 0 top
PCA9306  28.4,43.59 45 top
PI_HEADER  45.47,65.96 180 top
Q1  16.94,62.08 0 top
Q2  83.82,55.96 180 bottom
Q3  13.13,62.08 0 top
Q4  94.01,63.27 0 bottom
Q5  83.97,36.2 180 bottom
Q6  94.13,43.61 0 bottom
Q7  92.74,55.96 180 bottom
Q8  92.86,36.2 180 bottom
Q9  9.4,57 0 top
Q10  112.78,50.88 180 top
Q11  112.78,46.86 0 top
Q12  38.76,46.28 90 bottom
R1  82.85,59.41 270 bottom
R2  96.6,61.49 270 bottom
R3  15.09,64.74 270 top
R4  113.79,49.4 180 bottom
R5  83.03,39.65 270 bottom
R6  96.77,41.81 270 bottom
R7  86.44,56.36 270 bottom
R8  91.03,42.47 0 bottom
R9  90.73,61.95 0 bottom
R10  82.37,61.98 180 bottom
R11  91.77,59.44 270 bottom
R12  82.55,42.21 180 bottom
R13  91.9,39.67 270 bottom
R14  86.64,36.6 270 bottom
R15  112.83,53.92 0 top
R16  113.77,47.4 180 bottom
R17  16.59,33.1 0 top
R18  17.48,56.96 0 top
R19  11.33,64.97 0 top
R20  8.41,60.86 270 top
R21  110.06,46.53 270 top
R22  12.67,68.86 180 top
R23  24.51,47.88 225 top
R24  25.7,40.72 135 top
R25  59.21,49.3 270 top
R26  8.13,58.9 0 bottom
R27  8.13,56.87 0 bottom
R28  8.13,54.81 0 bottom
R29  115.11,32.33 0 top
R30  33.32,52.78 135 bottom
R31  24.41,50.47 315 bottom
R32  115.39,65.99 180 top
R33  31.78,36.27 270 bottom
R34  113,38.25 90 top
R35  8.89,47.37 0 bottom
R36  50.44,37.52 180 top
R37  47.27,42.65 0 top
R38  47.27,44.68 180 top
R39  47.55,40.11 90 top
R40  44.73,43.15 90 top
R41  45.49,40.11 270 top
R42  43.43,40.11 90 top
RGB_LED  5.08,55.88 270 top
SJ1  46.02,43.38 0 bottom
SJ2  34.67,31.5 270 top
SJ3  33.02,58.42 90 top
SJ4  35.56,58.42 90 top
SJ5  46.02,41.07 0 bottom
STEPPER  50.65,31.42 0 top
SUPPLY_IN  6.35,43.18 270 top
SUPPLY_IN1  6.35,35.56 270 top
TLE4905L  115.16,28.3 0 top
TLE4905L1  115.44,70.08 180 top
TLE4905L2  117.14,38.2 90 top
U1  26.34,55.88 90 top
U2  16.51,34.29 270 bottom
U4  16.57,54.74 90 bottom
U5  87.96,49.12 270 top
U$1  -1.27,-35.56 0 top  (outside the outline)
U$2  54.36,56.49 180 top
U$3  41.96,57.58 180 top
U$4  28.19,44.4 315 bottom
U$5  52.07,41.27 0 top
U$10  16.51,44.45 90 top

### Tracks (layer width: path | path; a pad name or v marks a point on that pad's centre or on a via)
+3V3  (via drill 0.35)  (8 unrouted)
  Top 0.254: C18.1 29.32,54.8 29.2,54.93 | U1.13 27.59,59.29 C20.1 | U$2.2 55.9,56.24 56.16,56.5 56.16,57.17 56.1,57.24 U$2.4 55.54,57.34 55.54,58.1 55.23,58.41 C22.1 | U1.8 29,55.13 29.2,54.93 | v29.18,52.07 29.2,54.93
  Top 0.305: C20.1 29.16,59.66 v29.18,59.64
  Top 0.406: U5.8 88.94,45.89 88.98,45.85 89.41,45.85 89.66,46.1 89.66,46.56 v90.04,46.94 | v20.83,49.38 21.41,49.96 22.26,49.96 23.05,50.75 v32,50.75 32,49.94 v34.01,48.49
  Top 0.61: SJ2.1 34.67,34.62 PCA9306.1 28.3,40.99 28.3,43.09 29.69,44.49 29.69,46.1 26.11,49.68 23.81,49.68 23.02,48.89 21.31,48.89 v20.83,49.38
  Top 1.016: U$3.4 41.96,58.85 U$3.3 45.77,58.85 C15.1 | JP4.1 JP3.1
  Bottom 0.305: U$4.48 26.29,50.19 25.89,50.19 R31.1 | C40.1 27.7,50.2 U$4.48 | U$4.48 29.72,46.76 29.72,45.92 30.12,45.52 31.08,45.52 U$4.9 33.75,48.18 v34.01,48.49 | U$4.24 29.27,39.43 | C38.1 29.11,39.43 29.27,39.43 | 18.64,41.13 C6.1 | C33.1 21.27,41.36 U$4.36 23.95,44.04 24.66,44.04 29.27,39.43 | C40.1 | v29.18,59.64 v29.18,52.07 28.7,52.55 28.52,52.55 27.82,51.85 C40.1
  Bottom 0.406: 16.79,53.98 17.22,54.41 U4.7 | IC1.2 17.32,51.65 16.79,52.17 16.79,53.98 | 16.79,53.98 16.79,54.9 15.98,55.71 U4.4 14.83,55.71 13.68,56.86 | 13.68,56.86 13.36,57.18 12.54,57.18 C25.1 | U2.4 17.17,33.3 16.85,33.62 16.85,35.61 17.06,35.82 18.09,35.82 18.36,36.09 C24.1 C23.1 C6.1 18.41,41.36 C33.1 | C26.1 14.17,57.35 13.68,56.86 | C39.1 34.51,50.75 v32,50.75
  Bottom 0.813: C4.1 19.56,47.5 20.83,48.77 v20.83,49.38
  Bottom 1.016: IC1.2 18.38,50.86
  Bottom 1.092: C6.1 arc0 C5.1 C7.1 C4.1 18.38,50.86
+5V  (via drill 0.35)  (13 unrouted)
  Top 0.305: 13.32,63.18 Q3.3 | Q3.3 13.09,63.18 12.98,63.29 12.98,65.65 12.8,65.83 11.55,65.83 11.37,65.65 11.37,63.77 9.4,61.8 Q9.3 9.4,55.22 9.72,54.89 11.02,54.89 v11.56,54.36 | Q3.3 14.23,64.28 14.23,64.52 14.41,64.7 15.76,64.7 15.94,64.52 15.94,64.18 Q1.3 | U$5.VIN 52.32,38.71 v53.19,37.85 | v51.82,44.93 U$5.VIN@1
  Top 0.406: v11.56,54.36 12.38,55.43 R18.1 14.67,59.87 14.94,60.13 14.94,61.82 14.73,62.03 14.24,62.03 13.09,63.18 | Q11.3 Q10.3 | C52.+ 50.24,48.18 51.82,46.61 v51.82,44.93
  Top 0.61: IC2.20 v82.55,65.38 | IC3.20 v82.7,45.62 | R29.2 117.19,31.11 TLE4905L.P1 | TLE4905L1.P1 113.41,67.12 R32.2 | TLE4905L2.P1 114.13,40.23 R34.2
  Bottom 0.305: SJ5.1 SJ1.1 48.06,43.38 49.89,41.55 49.89,40.56 50.65,39.8 50.84,39.8 C51.1 | v51.82,44.93 52.17,45.29 52.17,46.26 52.57,46.66 53.14,46.66 53.39,46.41 53.54,46.26 55.41,44.38 55.41,43.23 55.37,43.18 C45.2
  Bottom 0.406: IC1.1 16.23,52.2 16.23,54.11 15.93,54.41 U4.2 v11.56,54.36 | C2.1 R8.2 | v53.19,37.85 52.68,36.96 C50.1 | C51.1 C50.1 | C49.1 C50.1
  Bottom 0.61: C11.+ 88.27,59.6 | 88.27,59.6 85.18,59.6 | 85.18,59.6 84.45,60.32 84.45,61.98 | v82.55,65.38 84.45,63.98 84.45,61.98 | Q2.2 84.77,59.19 85.18,59.6 | R9.2 C1.1 88.05,59.82 88.27,59.6 | R10.2 84.45,61.98 | v82.7,45.62 84.92,43.4 84.92,42.24 | 84.92,42.24 84.92,40.51 | 84.92,40.51 Q5.2 | C14.+ 85.77,39.66 84.92,40.51 | R12.2 84.9,42.21 84.92,42.24 | TLE4905L.P1 117.19,29.54 117.61,29.96 C19.1 | TLE4905L1.P1 113.41,69.12 112.88,68.58 112.88,67.32 C32.1 | TLE4905L2.P1 116.06,40.23 115.53,40.75 C42.1
  Bottom 1.016: IC1.1 C8.1
+8V  (via drill 0.35)  (2 unrouted)
  Top 0.406: v16.51,31.75 15.49,33.1 R17.1
  Top 0.61: IC2.10 93.98,55.88 94.71,56.61 C9.+ | IC3.10 94.13,36.07 94.81,36.74 C12.+
  Top 1.016: 13.71,33.02 R17.1
  Top 1.27: v11.43,33.02 13.71,33.02
  Bottom 0.406: U2.2 18.69,34.62 18.69,34.52 19.32,33.89 19.32,32.74 18.77,32.18 17.18,32.18 16.83,32.17 v16.51,31.75
  Bottom 0.813: C41.1 10.39,65.5 D3.C
  Bottom 1.016: FAN.P1 6.43,65.35 C41.1
  Bottom 1.27: FAN.P1 5.13,62.43 C43.+ 5.35,61.81 2.92,59.39 2.92,34.04 5.21,31.75 10.16,31.75 v11.43,33.02
BMP_EOC  (via drill 0.35)
  Top 0.406: U$3.2 45.44,57.58 v45.49,57.53
BOOT0  (1 unrouted)
  Bottom 0.305: U$4.44 23.81,49.85 R31.2
BOOT1  (1 unrouted)
  Bottom 0.305: U$4.20 31.5,40.03 31.75,39.37 R33.1
CONV_5V  (via drill 0.35)
  Top 0.406: R18.2 17.09,53.77 12.01,53.77 11.86,53.62 11.25,53.62 11.1,53.77 10.08,53.77 v9.27,52.96
  Top 1.016: R18.2 20.27,53.13 U$10.OUT+
  Bottom 0.406: U4.1 12,53.76 11.86,53.62 11.25,53.62 11.15,53.72 10.03,53.72 v9.27,52.96
GND  (via drill 0.35, 0.45)  (32 unrouted)
  Top 0.254: 28.32,56.64 U1.11 29.12,56.63 29.26,56.77 29.26,58.17 29.65,58.56 C21.2 | U1.18 25.09,58.42 | 25.09,58.42 25.09,59.24 C20.2 25.52,60.34 25.63,60.45 29.52,60.45 30.48,59.49 30.48,58.61 C21.2 | C17.2 25,58.33 25.09,58.42 | C13.2 51.05,58.43 50.22,57.6 48.99,57.6 48.83,57.77 48.83,59.1 48.99,59.26 50.43,59.26 50.88,59.72 52.07,59.72 52.6,60.25 53.29,60.25 53.47,60.07 53.47,59.32 C22.2 | U1.1 25.09,53.31 24.77,52.98 22.92,52.98 22.89,53.02 | U1.9 31.02,55.63 | C21.2 31.05,58.56 31.21,58.4 31.21,55.82 31.02,55.63 | 32.88,54.5 32.91,54.5 | 31.02,55.63 31.42,55.23 31.42,53.92 31.88,53.47
  Top 0.305: C13.2 51.89,58.43 U$2.9 53.33,57.24 53.33,57.23 53.48,57.23 53.61,57.11 53.61,56.33 53.52,56.24 U$2.11 | R36.1 51.31,37.53 U$5.GND@4 v51.31,40.44 51.31,40.51 U$5.EXP | U$5.AGND 51.82,41.02 U$5.EXP | U$5.GND@3 53.34,40 v52.88,40.46 U$5.EXP | U$5.GND@2 v52.83,42.14 52.83,42.04 U$5.EXP | U$5.GND@1 50.8,42.55 v51.22,42.13 U$5.EXP | C48.2 46.82,38.26 46.97,38.41 47.3,38.41 47.55,38.66 R39.1
  Top 0.406: v21.89,54.66 21.89,54.01 22.89,53.02 22.89,51.38 22.59,51.07 | 22.59,51.07 22.03,50.52 20.28,50.52 18.6,52.2 U$10.OUT- | RGB_LED.P1 5.13,51.26 v7.57,49.28 | U5.4 86.98,52.1 86.36,52.73 IC2.4 | 30.56,53.01 30.42,53.09 | 30.42,53.09 C18.2 | 22.59,51.07 22.82,51.31 30,51.31 30.45,51.77 30.45,52.35 | 22.59,51.07 | 30.45,52.35 30.45,53.06 30.42,53.09 | v33.71,55.3 32.91,54.5 31.88,53.47 31.5,53.09 31.5,52.58 31.27,52.35 30.45,52.35 | U$5.GND@1 50.8,43.44 50.66,43.66 50.5,43.66 50.04,44.13 50.04,44.98 48.03,46.99 44.45,46.99 43.74,47.7 C52.-
  Top 0.61: IC2.14 IC2.7 IC2.6 | IC2.6 IC2.15 | IC2.16 IC2.5 | IC2.16 IC2.17 IC2.4 IC2.5 | IC2.16 IC2.15 | IC2.14 IC2.15 | IC2.5 IC2.6 | IC2.14 v90.17,65.39 | IC3.14 IC3.7 IC3.6 | IC3.6 IC3.15 | IC3.16 IC3.5 | IC3.16 IC3.17 IC3.4 IC3.5 | IC3.16 IC3.15 | IC3.15 IC3.14 | IC3.6 IC3.5 | IC3.14 90.32,45.55 v90.22,45.62 | 22.43,31.47 v22.28,31.62
  Top 0.813: C27.- v7.57,49.28 | U$10.IN- 9.88,36.7 8.99,35.81 8.99,33.12 11.73,30.38 21.77,30.38 22.28,30.89 v22.28,31.62 | IRLML2502.2 8.33,69.22 v9.09,69.98
  Top 1.016: U$10.OUT- 10.16,50.55 10.16,48.26 | U$3.8 41.96,56.31 U$3.1 45.77,56.31 C15.2 | JP4.3 JP3.3
  Top 1.27: C27.- 9.8,49.89 v8.89,50.8
  Top 2.032: U$10.IN- 13.21,38.1 v13.97,38.1
  Bottom 0.305: U$4.47 27.58,48.19 27.58,41.83 U$4.23 30.7,38.71 30.7,38.21 30.71,37.39 29.59,36.24 | U$4.35 21.34,40.72 21.34,40.03 20.97,39.66 C33.2 | C40.2 24.89,54.66 v21.89,54.66 | v51.22,42.13 52.82,42.13 v52.83,42.14 | U$4.8 31.21,46.35 v30.58,46.35
  Bottom 0.406: U4.8 18.63,53.76 19.05,53.76 | U2.3 18.47,33.96 18.55,33.87 18.56,33.87 18.77,33.66 18.77,32.97 18.54,32.74 17.18,32.74 16.95,32.73 16.95,32.74 16.94,32.74 16.78,32.9 16.62,33.05 16.62,33.06 16.3,33.38 16.3,34.62 | 16.3,34.62 16.3,35.26 | 16.3,35.26 16.3,35.84 16.68,36.22 C24.2 C23.2 C6.2 | 16.3,35.26 U2.8 U2.7 16.3,34.62 | 11.78,52.23 U$10.OUT- | 19.05,53.76 20.5,53.75 v21.89,54.66 | Q7.2 92.63,56 90.29,56 88.89,54.6 C11.- | Q8.2 92.76,36.24 90.66,36.24 C14.- | C26.2 18.34,57.35 19.05,56.64 19.05,53.76 | C25.2 12.96,55.06 U4.3 | C39.2 R30.2 34.05,53.38 C37.1 34.7,55.3 v33.71,55.3 | C51.2 C50.2 C49.2
  Bottom 0.508: JP3.3 37.35,36.94
  Bottom 0.61: Q7.2 93.69,59.3 93.09,59.89 93.09,62.14 Q4.2 | R7.1 87.23,57.21 87.25,57.23 88.75,55.73 C11.- | v90.17,65.39 86.35,62.08 C1.2 | Q8.2 93.81,38.93 93.18,39.56 Q6.2 | R14.1 87.39,37.45 89.08,35.76 C14.- | v90.22,45.62 89,44.32 88.42,44.32 87.16,43.07 C2.2 | C30.1 115.16,31.01 | 115.16,31.01 C19.2 | TLE4905L.P2 115.16,28.37 115.16,31.01 | C35.1 115.44,67.31 | 115.44,67.31 C32.2 | TLE4905L1.P2 115.41,67.34 115.44,67.31 | C44.1 114.4,38.2 | 114.4,38.2 114.4,39.03 C42.2 | TLE4905L2.P2 114.43,38.23 114.4,38.2 | C36.1 39.66,39.25 37.35,36.94 35.83,35.42 R33.2
  Bottom 0.813: v7.57,49.28 C16.2 | 10.16,62.39 C43.- 11.93,60.63 12.7,60.63 | 12.7,60.63 18.17,60.63 21.59,57.2 21.59,54.97 v21.89,54.66 | C38.2 29.09,36.72 29.59,36.24 | v9.09,69.98 11.3,69.98 12.7,68.58 12.7,60.63 | R33.2 30.45,35.43 29.59,36.24 | v22.28,31.62 22.28,33.71 24.13,35.56 28.91,35.56 29.59,36.24
  Bottom 1.016: v13.97,38.1 14.54,38.67 IRF7401.8 IRF7401.7 IRF7401.6 IRF7401.5 14.53,45.22 D2.A | C6.2 C5.2 C7.2 C4.2 | C4.2 16.55,47.37 D2.A | IC1.3 16.64,47.54 C4.2 | C8.2 14.53,49.52 D2.A
  Bottom 1.27: v8.89,50.8 9.74,49.95 C8.2
  other vias: 52.07,41.27
HALL_1
  Top 0.61: R29.1 113.19,31.26 TLE4905L.P3
  Bottom 0.61: TLE4905L.P3 113.19,29.38 112.78,29.79 112.78,31 C30.2
HALL_2
  Top 0.61: R32.1 117.41,67.16 TLE4905L1.P3
  Bottom 0.61: TLE4905L1.P3 117.41,69.02 117.91,68.53 117.89,68.52 C35.2
HALL_3
  Top 0.61: R34.1 114.18,36.23 TLE4905L2.P3
  Bottom 0.61: TLE4905L2.P3 115.93,36.23 115.43,35.73 C44.2
M_DIR_1  (via drill 0.35)  (2 unrouted)
  Bottom 0.305: R1.1 82.88,60.29 83.96,59.2 83.96,56.23 84.14,56.05 85.4,56.05 85.58,56.23 85.58,58.09 90.07,58.09 90.25,58.27 90.25,58.77 R11.1 90.96,61.1 90.95,61.1 90.77,61.27 90.77,65.03 90.85,65.11 90.85,65.67 90.8,65.72 90.8,66.67 | U$4.17 32.51,41.15 v33.93,39.8
M_DIR_2
  Bottom 0.305: R5.1 84.12,39.41 84.12,36.47 84.3,36.29 85.55,36.29 85.73,36.47 85.73,38.12 86.66,39.05 86.86,39.05 87.75,38.16 90.4,38.16 90.58,38.33 90.58,39.21 R13.1 91.9,40.97 90.99,41.88 90.99,46.83 90.96,46.86
N$1  (via drill 0.35)
  Top 0.61: v92.71,52.27 IC2.9 IC2.12 v92.71,65.43
  Bottom 0.61: v92.71,52.27 92.71,54.83 Q7.3 | v92.71,65.43 92.71,64.77 91.58,63.64 R9.1
N$2  (1 unrouted)
  Top 0.61: 84.73,44.35 84.73,45.13 83.41,46.45 82.36,46.45 80.6,44.69 80.6,33.77 82.33,32.03 86.74,32.03 87.4,31.37 MOTOR_LEFT.P3
  Bottom 0.61: C31.2 87.23,29.29 MOTOR_LEFT.P3
N$3  (2 unrouted)
  Top 0.61: IC3.13 91.12,44.31 91.12,47.69 90.17,48.64 83.47,48.64 79.83,45.01 79.83,33.45 82.02,31.27 84.96,31.27 85.4,30.83 MOTOR_LEFT.P4
  Bottom 0.61: C31.1 85.53,29.17 MOTOR_LEFT.P4
N$4
  Bottom 0.406: R26.2 RGB_LED.P4
N$5  (via drill 0.35)
  Top 0.61: IC2.19 IC2.2 v83.82,52.7
  Bottom 0.61: v83.82,52.7 Q2.3 85.8,54.86 R7.2
N$6  (via drill 0.35)
  Top 0.61: v92.84,32.77 IC3.9 IC3.12 v92.86,45.62
  Bottom 0.61: v92.84,32.77 92.84,32.92 Q8.3 | v92.86,45.62 91.88,44.64 R8.1
N$7  (via drill 0.35)
  Top 0.61: IC3.19 IC3.2 83.97,32.92 v83.95,32.89
  Bottom 0.61: R14.2 85.98,35.09 Q5.3 83.95,35.07 v83.95,32.89
N$8  (via drill 0.35)
  Top 0.61: 82.54,54.45 IC2.1 | IC2.1 82.55,52.76 v82.52,52.73 | IC2.11 93.98,65.02 95.36,65.02 v95.4,65.07 | IC2.1 82.55,60.32 81.23,61.65 v81.23,63.75
  Bottom 0.406: Q4.3 94,59.91 94.54,59.38 94.54,53.07 93.01,51.54 92.41,51.54 91.24,52.7 89.53,52.7 89.51,52.73 84.88,52.73 84.12,51.97 83.52,51.97 82.76,52.73 v82.52,52.73
  Bottom 0.61: R10.1 81.52,63.26 v81.23,63.75 | Q4.3 94.7,65.07 v95.4,65.07
N$9  (via drill 0.35)
  Top 0.61: IC3.11 94.13,45.34 95.35,45.34 v95.38,45.31 | v81.43,43.87 81.43,41.15 82.7,39.88 IC3.1 82.7,32.89 v82.68,32.87
  Bottom 0.406: Q6.3 94.13,39.54 94.67,39.01 94.67,33.56 93.14,32.03 92.53,32.03 91.7,32.87 84.96,32.87 84.25,32.16 83.64,32.16 82.94,32.87 v82.68,32.87
  Bottom 0.61: v95.38,45.31 94.73,45.31 Q6.3 | R12.1 81.7,43.6 v81.43,43.87
N$10
  Bottom 0.61: R1.2 82.85,57.07 Q2.1
N$11
  Bottom 0.61: Q7.1 91.78,58.57 R11.2
N$12
  Bottom 0.61: R2.2 94.95,60.63 Q4.1
N$13
  Bottom 0.61: Q5.1 83.03,37.3 R5.2
N$14
  Bottom 0.61: 95.24,42.35 Q6.1 95.08,41.11 95.24,40.96 R6.2
N$15
  Bottom 0.61: Q8.1 91.91,38.81 R13.2
N$16
  Bottom 0.406: R27.2 5.16,56.87 RGB_LED.P3
N$17
  Top 0.61: MOTOR_RIGHT.P4 91.46,63.68 IC2.13
  Bottom 0.61: C29.1 91.46,67.6 MOTOR_RIGHT.P4
N$18
  Top 0.61: IC2.18 85.09,65.05 85.49,65.45 85.5,65.45 87.18,67.13 88.7,67.13 89.46,67.9 MOTOR_RIGHT.P3
  Bottom 0.61: C29.2 89.7,69.72 MOTOR_RIGHT.P3
N$19
  Bottom 0.406: R28.2 5.21,54.81 RGB_LED.P2
N$20
  Top 0.61: 84.48,51.11 84.45,51.11 | 84.45,51.11 81.89,51.11 79.63,53.36 79.63,64.72 81.89,66.98 84.76,66.98 85.46,67.68 MOTOR_RIGHT.P1 | 84.45,51.11 86.08,49.48 90.12,49.48 91.44,50.8 IC2.8
  Bottom 0.61: C28.2 85.61,69.81 MOTOR_RIGHT.P1
N$21
  Top 0.61: IC2.3 85.09,52.82 85.06,52.8 85.06,52.77 84.17,51.87 82.2,51.87 80.39,53.68 80.39,64.41 82.2,66.22 85.19,66.22 87.46,68.49 MOTOR_RIGHT.P2
  Bottom 0.61: C28.1 87.31,69.8 MOTOR_RIGHT.P2
N$22
  Top 0.406: R3.2 15.99,62.76 Q1.1
N$23
  Top 0.406: Q3.1 R19.2
N$24  (via drill 0.35)
  Top 0.305: 17.78,60.87 Q1.2 17.83,60.92 v17.83,59.46
  Bottom 0.305: R28.1 10.36,54.81 11.43,55.88 11.43,58.24 12.65,59.46 v17.83,59.46
N$25
  Top 0.61: MOTOR_LEFT.P1 91.45,31.81 91.57,31.93 91.57,34.62 IC3.8
  Bottom 0.61: MOTOR_LEFT.P1 91.45,31.3 C3.2
N$26
  Top 0.61: MOTOR_LEFT.P2 89.4,31.91 88.22,33.09 85.53,33.09 85.24,33.38 IC3.3
  Bottom 0.61: MOTOR_LEFT.P2 89.52,29.16 C3.1
N$27
  Top 0.406: Q10.1 113.73,53.88 R15.2
N$28  (via drill 0.35)
  Top 0.305: v11.05,58.83 11.91,59.69 13.66,59.69 14.08,60.11 Q3.2
  Bottom 0.305: R27.1 9.88,56.87 10.16,57.15 10.16,57.94 v11.05,58.83
N$29  (via drill 0.35)
  Top 0.406: Q9.2 10.35,59.17 v10.41,60.07
  Bottom 0.305: v10.41,60.07 9.37,58.9 R26.1
N$30  (via drill 0.35)
  Top 0.406: Q10.2 110.1,51.98 v110.08,51.99
  Bottom 0.406: v110.08,51.99 110.08,51.21 111.89,49.4 R4.1
N$31
  Top 0.406: R21.2 111.75,45.68 Q11.1
N$32
  Top 0.406: Q9.1 8.45,59.97 R20.2
N$33  (via drill 0.35)
  Top 0.406: Q11.2 113.73,44.67 v114.45,43.94
  Bottom 0.406: v114.45,43.94 112.92,45.48 R16.1
N$34
  Top 0.254: U1.20 C17.1 | C17.1
N$35
  Bottom 0.406: LED.P1 116.93,47.4 R16.2
N$36
  Top 0.254: U1.10 30.3,56.13 30.43,56.26 C21.1
N$37
  Top 0.813: R22.2 IRLML2502.3
N$38
  Top 0.305: U$2.12 50.6,55.74 C10.2
N$39
  Top 0.305: C10.1 50.21,58.43 51.06,59.29 52.6,59.29 52.68,59.21 52.68,58.63 52.86,58.45 53.43,58.45 53.61,58.28 U$2.8
N$40
  Top 0.305: U$2.10 C13.1
N$41  (via drill 0.35)
  Top 0.61: R23.2 23.91,47.18 PCA9306.7 PCA9306.8 23.85,45.44 23.22,45.44 22.86,45.09 22.86,43.74 R24.2 25.1,38.84 27.73,36.21 27.73,34.8 v27.96,34.57 | SJ2.2 31,31.5 I2C.P1
  Bottom 0.61: v27.96,34.57 29.57,34.57 30.97,33.16 I2C.P1
N$42
  Top 0.61: PCA9306.6 25.88,47 25.88,47.71 R23.1 23.68,48.48 22.1,46.89 22.1,43.75 22.09,43.45 22.1,43.44 22.1,43.42 22.31,43.21 23.91,41.48 23.9,41.47 23.9,38.96 26.97,35.89 I2C.P3
N$43
  Top 0.61: PCA9306.5 28.93,45.75 28.93,44.81 27.3,43.18 27.3,41.11 R24.1 28.97,37.45 I2C.P2
N$44  (1 unrouted)
N$45  (1 unrouted)
N$46
  Bottom 0.305: U$4.6 32.92,49.48 33.57,49.48 33.88,49.17 34.29,49.17 35.38,48.08 35.56,47.91 35.89,47.57 35.89,43.46 36.27,43.08 Q12.1
  Bottom 0.61: Q12.1 37.51,41.79 37.96,41.34 C36.2
N$47
  Bottom 0.305: U$4.5 32.98,50.24 33.45,50.24 34.04,49.66 35.46,49.66 36.68,50.88 38.34,50.88 38.52,50.7 38.52,49.72 38.76,49.48 Q12.3
  Bottom 0.61: C37.2 37.92,52.07 39.42,52.07 40.01,51.48 Q12.3
N$48
  Bottom 0.406: R4.2 116.94,49.4 LED.P2
N$49  (2 unrouted)
  Bottom 0.305: U$4.2 30.4,49.78
N$50
  Bottom 2.032: SUPPLY_IN1.2 SUPPLY_IN.1
N$51  (via drill 0.35)
  Top 0.305: U$5.VCP 54.73,40.51 55.37,39.71 v55.37,38.94
  Bottom 0.305: v55.37,38.94 C45.1
N$52  (via drill 0.35)
  Top 0.305: U$5.NSLEEP 53.34,44.14 v53.37,44.17 | v49.3,44.68 R38.1
  Bottom 0.305: v49.3,44.68 50.8,43.18 52.38,43.18 v53.37,44.17
N$53
  Top 0.305: C46.2 55.54,40.4 54.92,41.02 U$5.CP2
N$54
  Top 0.305: C46.1 55.64,42.1 55.07,41.53 U$5.CP1
N$55  (via drill 0.35)
  Top 0.813: 5.05,67.43 FAN.P2 7.69,67.35 8.2,66.83 IRLML2502.1 10.22,67.75 14.26,67.75 14.68,68.17 v15.75,68.17
  Bottom 0.813: D3.A 15.73,68.16 v15.75,68.17
  Bottom 1.016: FAN.P2 6.25,67.32 C41.2
N$56  (1 unrouted)
  Bottom 0.508: D2.C R35.1 9.4,46.74 9.4,45.51 9.34,45.45
N$57
  Top 0.305: U$5.VG 54.61,42.04 | 54.61,42.04 54.73,42.04 | 54.61,42.04 55.73,43.16 C47.2
N$58  (via drill 0.35)
  Top 0.305: U$5.ROSC v49.05,40.51 | R36.2 49.54,37.46 v48.26,37.46
  Bottom 0.305: v48.26,37.46 49.05,38.25 v49.05,40.51
N$59
  Top 0.305: U$5.NFAULT 49.4,42.04 48.79,42.65 R37.2
N$60  (1 unrouted)
  Bottom 2.032: SUPPLY_IN1.1 9.34,36.75 IRF7401.1
  Bottom 2.21: IRF7401.3 arc0 IRF7401.1
N$61  (via drill 0.35)
  Top 0.305: U$5.BOUT2 52.83,38.85 53.15,38.53 53.47,38.53 53.87,38.13 53.87,36.3 v55.25,34.92
  Bottom 0.305: STEPPER.P1 53.63,33.31 v55.25,34.92
N$62  (via drill 0.35)
  Top 0.305: v52.86,45.97 52.86,44.63 52.32,44.09 U$5.AOUT2
  Bottom 0.305: v52.86,45.97 52.86,45.64 54.05,44.45 54.05,35.63 51.63,33.21 STEPPER.P2
N$63
  Top 0.305: U$5.ISET 49.1,41.53 48.53,40.96 R39.2 R41.1 44.73,41.72 R40.1
N$64
  Top 0.305: STEPPER.P3 49.63,33.12 52.1,35.59 52.1,38.19 51.82,38.48 U$5.BOUT1
N$65  (via drill 0.35)
  Top 0.305: R40.2 43.85,44 v43.21,44.65
  Bottom 0.305: SJ1.2 44.48,43.38 v43.21,44.65
N$66  (via drill 0.35)
  Top 0.305: R42.2 43.41,40.98 v43.41,42.34
  Bottom 0.305: SJ5.2 44.37,41.07 44.17,41.27 44.17,41.58 v43.41,42.34
N$67
  Top 0.305: R42.1 R41.2 45.49,38.56 45.12,38.19 C48.1
N$68  (via drill 0.35)
  Top 0.305: U$5.AOUT1 51.31,43.59 v50.8,44.4
  Bottom 0.305: v50.8,44.4 51.13,44.73 51.13,45.86 52.39,47.11 53.33,47.11 56.48,43.96 56.48,31.72 53.98,29.21 48.26,29.21 47.62,29.84 STEPPER.P4
NRST  (1 unrouted)
PWM_M_EN_1  (via drill 0.35)  (1 unrouted)
  Bottom 0.305: U$4.16 33.85,40.52 33.88,40.48 34.22,40.48 34.98,39.73 v34.98,38.76
PWM_M_EN_2  (via drill 0.35)  (1 unrouted)
  Bottom 0.305: U$4.18 32.23,40.72 32.87,40.08 32.87,39.85 33.93,38.79 v33.93,37.72
S_DIR  (via drill 0.35)  (1 unrouted)
  Top 0.305: U$5.DIR 49.71,42.55 49.3,42.95 v49.3,43.51
  Bottom 0.305: U$4.14 34.93,40.84 v34.98,40.84
S_NENBL  (1 unrouted)
  Top 0.305: U$5.NENBL 54.38,42.55 54.73,42.89 54.73,43.51
S_PWM_SPEED  (via drill 0.35)
  Bottom 0.305: U$4.19 31.67,40.56 31.9,40.34 32.26,39.98 32.26,39.39 v32.89,38.76
S_SLEEP
  Top 0.305: R38.2 R37.1
S_STEP
  Top 0.305: U$5.STEP 54.46,40 54.64,39.83 54.64,38.05 54.56,37.97
SCL  (4 unrouted)
SDA  (4 unrouted)
SWDIO  (1 unrouted)
TEMPERATURE  (2 unrouted)
  Top 0.406: U5.1 88.94,52.26 89.38,52.7 90.09,52.7
USART2_RX  (via drill 0.35)  (1 unrouted)
  Bottom 0.305: U$4.13 33.81,42.67 34,42.64 v34.87,43.36
USART2_TX  (via drill 0.35)  (1 unrouted)
  Bottom 0.305: U$4.12 33.99,46.3 34.37,46.3 34.65,46 v34.57,45.29
V+  (via drill 0.35)
  Top 0.813: C27.+ v6.98,47.62
  Top 2.54: R17.2 arc0 21.21,33.66 U$10.IN+ 13.03,44.88 SUPPLY_IN.2
  Bottom 0.406: U2.1 18.87,35.26 U$10.IN+
  Bottom 0.813: R35.2 v6.98,47.62 6.14,47.58 5.66,47.58 5.33,47.91 5.33,48.05 C16.1
  Bottom 1.778: SUPPLY_IN.2 6.35,46.99 v6.98,47.62